# EasyEDA Pro project 电赛云台(升压版).eprj

# Schematic Schematic1

## Sheets
1 主控: Board Name: Board1; Create Date: 2025-06-14; Page Name: 主控; Project Name: 电赛云台(升压版); Schematic Name: Schematic1; Update Date: 2025-07-06; Company: 嘉立创EDA; Page Size: A4; Version: V1.0
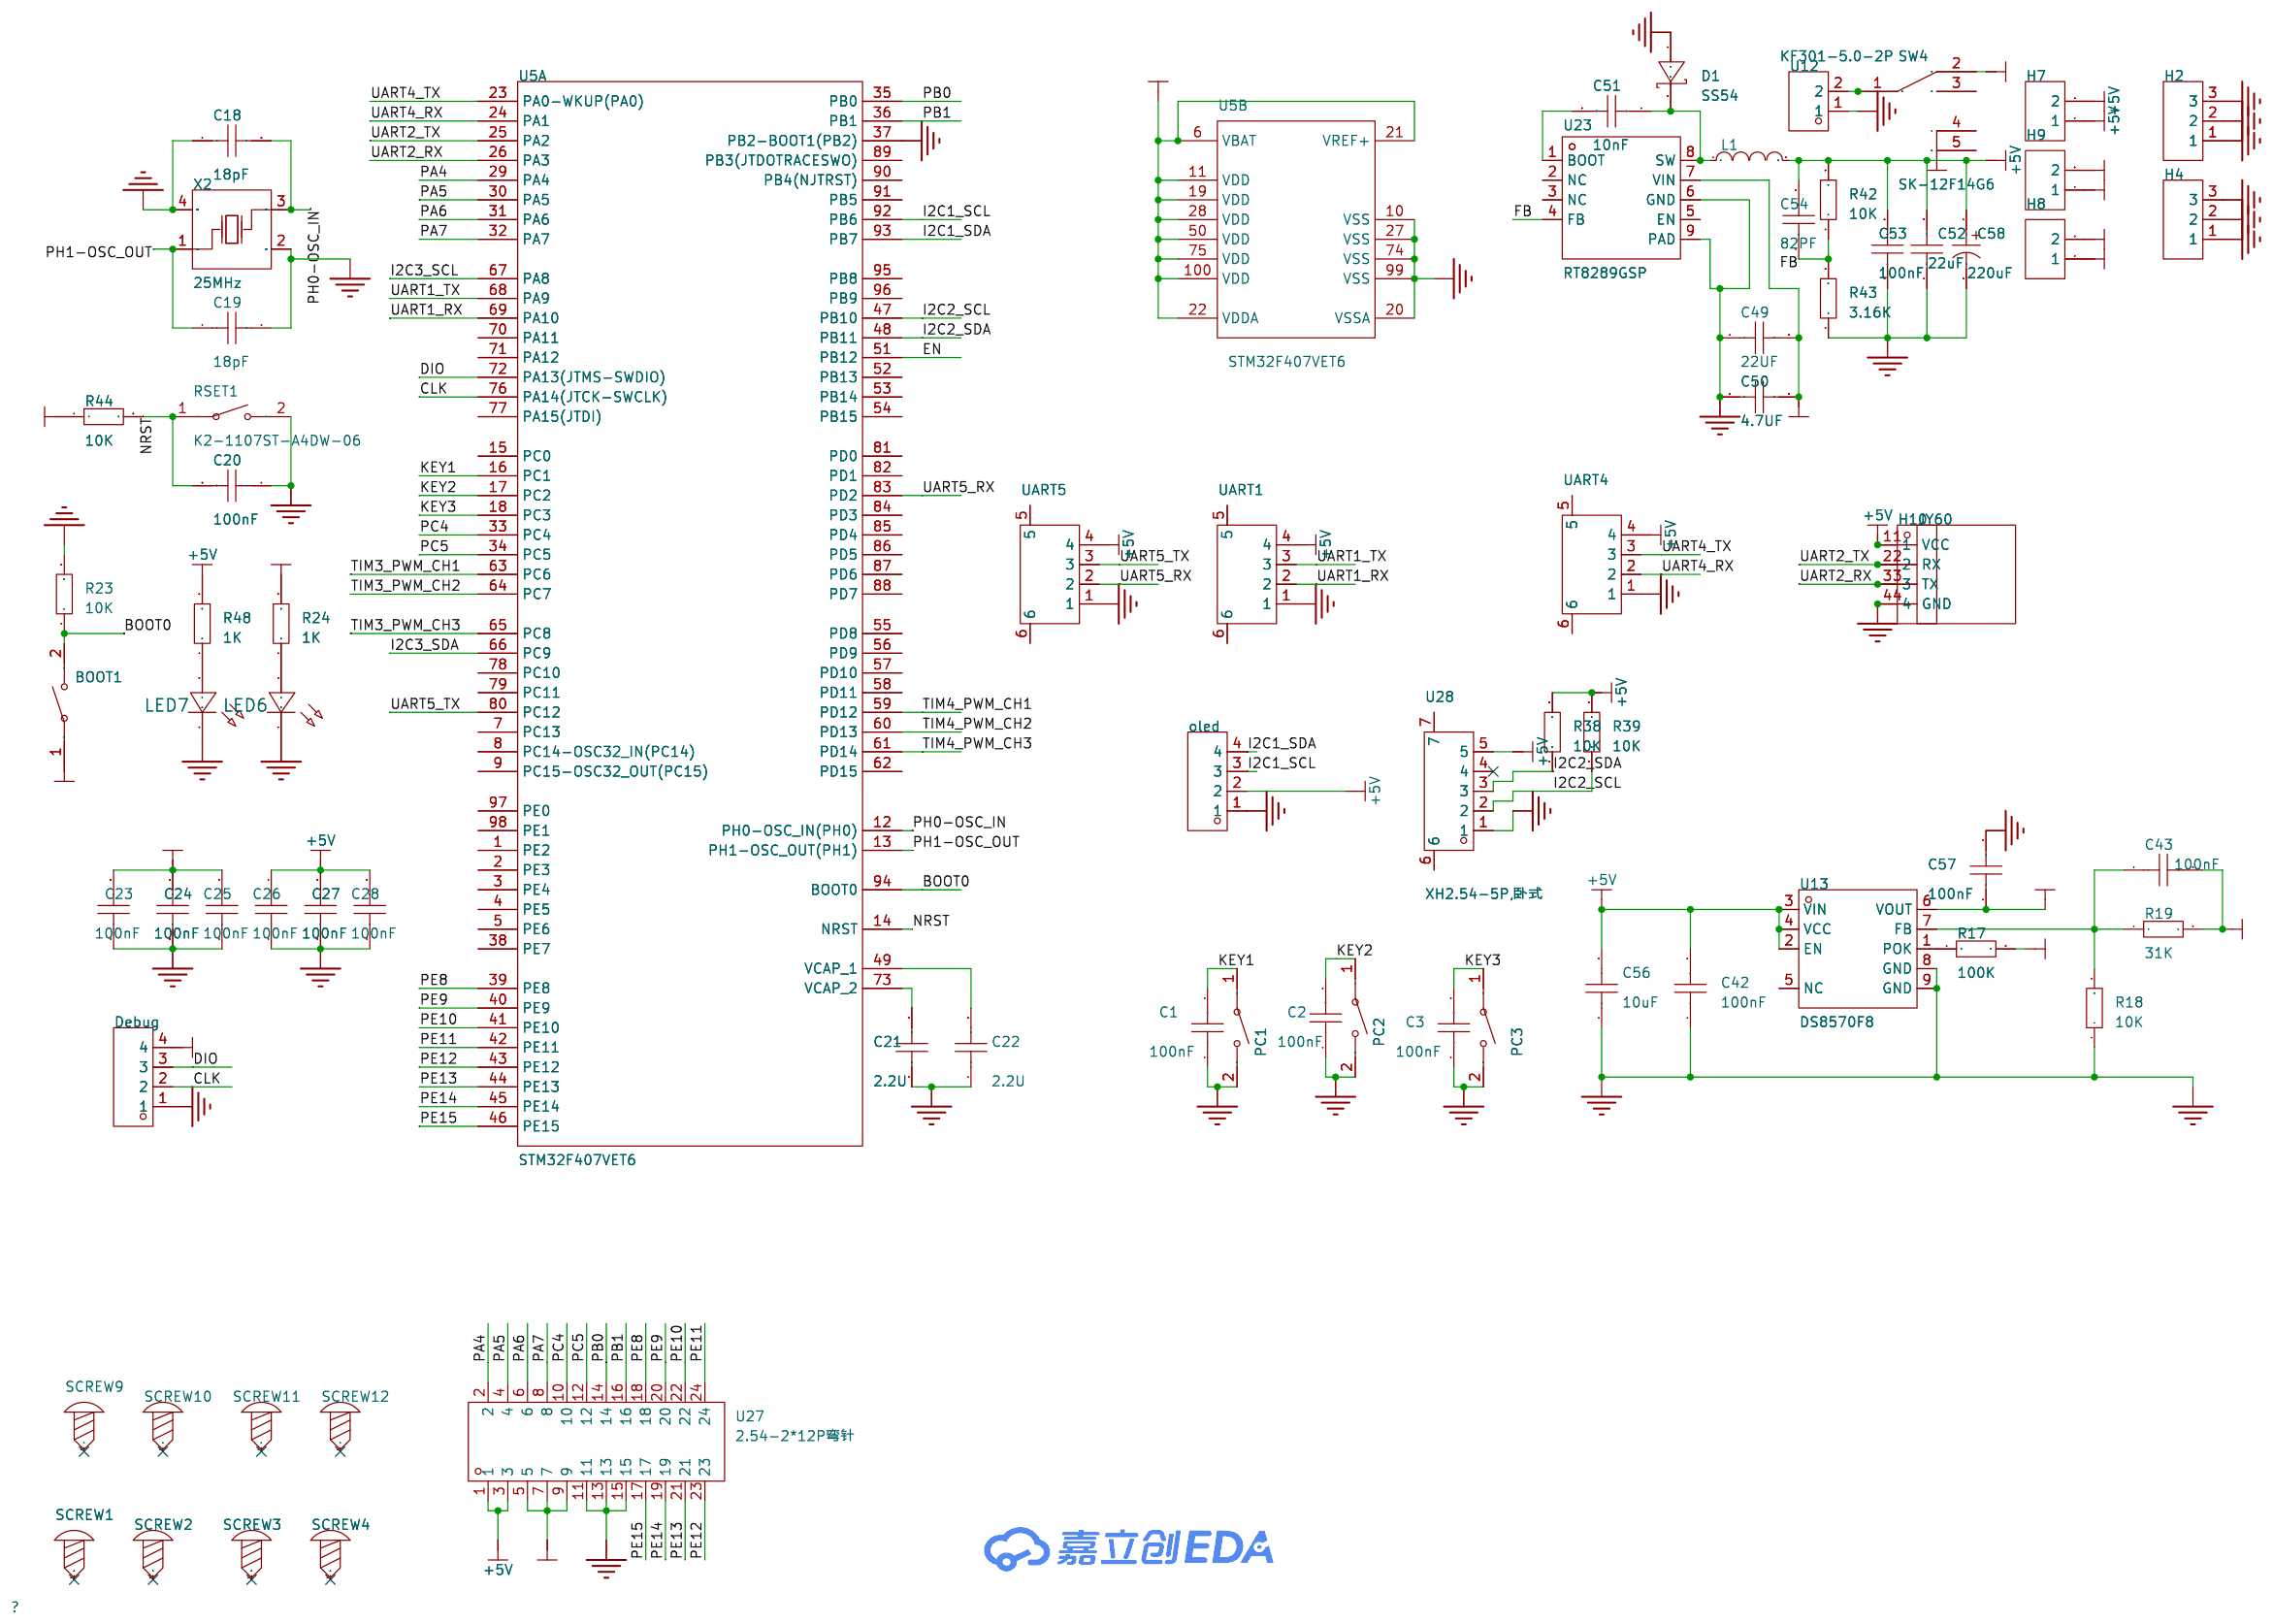
[diagram p0: 主控]
2 驱动: Page Name: 驱动
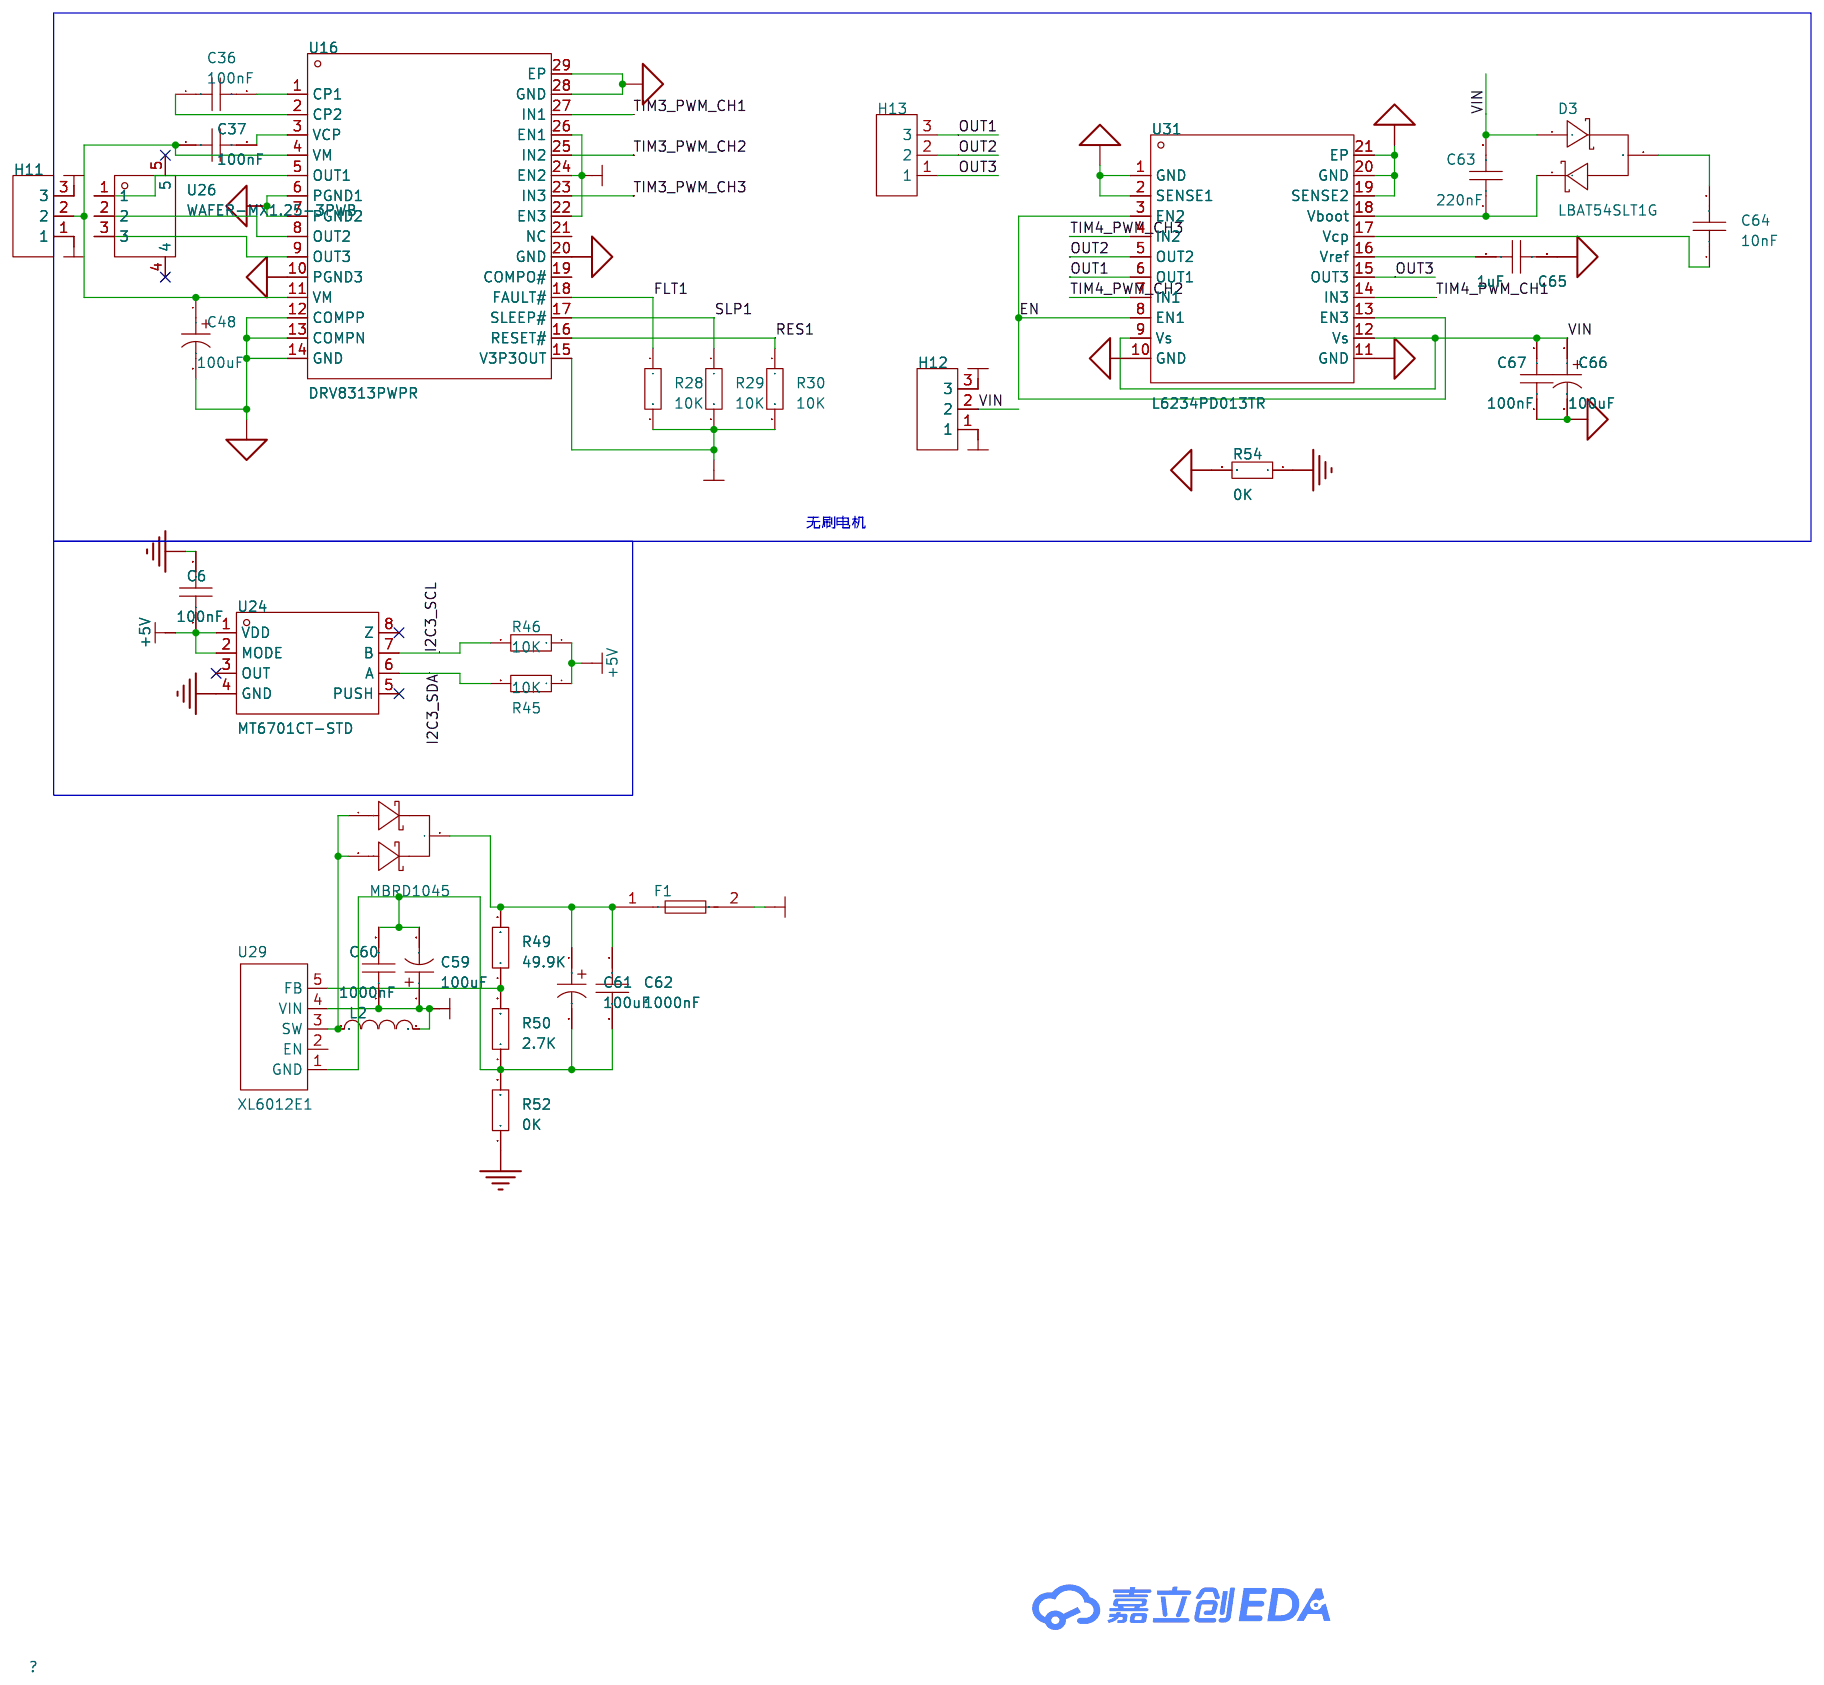
[diagram p1: 驱动]

## Parts
sheet 主控
BOOT1  K2-1107ST-A4DW-06  [KEY-SMD_L6.2-W3.6-LS8.0]
C1  100nF  [C0603]
C2  100nF  [C0603]
C3  100nF  [C0603]
C18  18pF  [C0603]
C19  18pF  [C0603]
C20  100nF  [C0603]
C21  2.2U  [C0805]
C22  2.2U  [C0805]
C23  100nF  [C0603]
C24  100nF  [C0603]
C25  100nF  [C0603]
C26  100nF  [C0603]
C27  100nF  [C0603]
C28  100nF  [C0603]
C42  100nF  [C0603]
C43  100nF  [C0603]
C49  22UF  [C0805]
C50  4.7UF  [C0805]
C51  10nF  [C0805]
C52  22uF  [C0805]
C53  100nF  [C0805]
C54  82PF  [C0805]
C56  10uF  [C0603]
C57  100nF  [C0603]
C58  220uF  [CAP-SMD_BD6.3-L6.6-W6.6-FD]
D1  SS54  [SMA_L4.4-W2.8-LS5.4-R-RD]
Debug  -  [HDR-TH_4P-P2.54-V-F]
H2  -  [HDR-TH_3P-P2.54-V-F]
H4  -  [HDR-TH_3P-P2.54-V-F]
H7  -  [HDR-TH_2P-P2.54-V-F]
H8  -  [HDR-TH_2P-P2.54-V-F]
H9  -  [HDR-TH_2P-P2.54-V-F]
H10  -  [HDR-TH_4P-P2.54-V-F]
JY60  -  [JY60]
L1  APCI00121280150MB2-22uH  [IND-SMD_L12.0-W12.0_744771008]
LED6  -  [LED_0805]
LED7  -  [LED_0805]
oled  -  [HDR-TH_4P-P2.54-V-F]
PC1  K2-1107ST-A4DW-06  [KEY-SMD_L6.2-W3.6-LS8.0]
PC2  K2-1107ST-A4DW-06  [KEY-SMD_L6.2-W3.6-LS8.0]
PC3  K2-1107ST-A4DW-06  [KEY-SMD_L6.2-W3.6-LS8.0]
R17  100K  [R0603]
R18  10K  [R0603]
R19  31K  [R0603]
R23  10K  [R0603]
R24  1K  [R0603]
R38  10K  [R0603]
R39  10K  [R0603]
R42  10K  [R0603]
R43  3.16K  [R0603]
R44  10K  [R0603]
R48  1K  [R0603]
RSET1  K2-1107ST-A4DW-06  [KEY-SMD_L6.2-W3.6-LS8.0]
SCREW1  -  [M3螺丝]
SCREW2  -  [M3螺丝]
SCREW3  -  [M3螺丝]
SCREW4  -  [M3螺丝]
SCREW9  -  [M3螺丝]
SCREW10  -  [M3螺丝]
SCREW11  -  [M3螺丝]
SCREW12  -  [M3螺丝]
SW4  SK-12F14G6  [SW-TH_SK-12F14-G]
U5  STM32F407VET6  [LQFP-100_L14.0-W14.0-P0.50-LS16.0-BL]  (sections 1,2)
U12  KF301-5.0-2P  [CONN-TH_P5.00_KF301-5.0-2P]
U13  DS8570F8  [ESOP-8_L4.9-W3.9-P1.27-LS6.0-BL-EP-1]
U23  RT8289GSP  [SOIC-8_L5.0-W4.0-P1.27-LS6.0-BL-EP2.0]
U27  2.54-2*12P弯针  [HDR-TH_24P-P2.54-H-M-R2-C12-S2.54]
U28  XH2.54-5P,卧式  [CONN-SMD_5P-P2.50_XUNPU_WAFER-254W-5P]
UART1  PH2.0-4P WT  [CONN-SMD_PH2.0-4PWB]
UART4  PH2.0-4P WT  [CONN-SMD_PH2.0-4PWB]
UART5  PH2.0-4P WT  [CONN-SMD_PH2.0-4PWB]
X2  25MHz  [CRYSTAL-SMD_4P-L3.2-W2.5-BL]
sheet 驱动
C6  100nF  [C0603]
C36  100nF  [C0603]
C37  100nF  [C0603]
C48  100uF  [CAP-SMD_BD6.3-L6.6-W6.6-FD]
C59  100uF  [CAP-SMD_BD6.3-L6.6-W6.6-FD]
C60  1000nF  [C0603]
C61  100uF  [CAP-SMD_BD6.3-L6.6-W6.6-FD]
C62  1000nF  [C0603]
C63  220nF  [C0805]
C64  10nF  [C0805]
C65  1uF  [C0805]
C66  100uF  [CAP-SMD_BD6.3-L6.6-W6.6-FD]
C67  100nF  [C0805]
D2  MBRD1045  [TO-252-3_L6.5-W5.9-P4.60-LS10.0-BL]
D3  LBAT54SLT1G  [SOT-23_L2.9-W1.3-P1.90-LS2.4-BR]
F1  保险管座(插件),AC250V/10A,脚距23mm,配φ5  [FUSE-TH_L28.8-W10.0_C9900019320]
H11  -  [HDR-TH_3P-P2.54-V-F]
H12  -  [HDR-TH_3P-P2.54-V-F]
H13  -  [HDR-TH_3P-P2.54-V-F]
L2  APCI00121280150MB2-22uH  [IND-SMD_L12.0-W12.0_744771008]
R28  10K  [R0603]
R29  10K  [R0603]
R30  10K  [R0603]
R45  10K  [R0805]
R46  10K  [R0805]
R49  49.9K  [R0805]
R50  2.7K  [R0805]
R52  0K  [R2010]
R54  0K  [R2010]
U16  DRV8313PWPR  [HTSSOP-28_L9.8-W4.5-P0.65-LS6.6-BL-EP]
U24  MT6701CT-STD  [SOP-8_L4.9-W3.9-P1.27-LS6.0-BL]
U26  WAFER-MX1.25-3PWB  [CONN-SMD_3P-P1.25_WAFER-MX1.25-3PWB]
U29  XL6012E1  [TO-220-5L_L10.2-W4.5-P1.71-L]
U31  L6234PD013TR  [POWERSO20_L15.9-W11.0-P1.27-LS14.2-BL-EP]

## Library data of the parts
BOOT1 PC1-PC3 RSET1 = K2-1107ST-A4DW-06: 电路结构:单刀单掷;按钮形状:矩形按钮;作用力:250gf;安装方式:立贴;开关长度:6.1mm;开关宽度:3.6mm;开关高度:2.5mm;触点电流:50mA;额定电压(DC):12V;绝缘电阻:100MΩ;带灯:-;机械寿命:10万次;; LCSC Part Name: 轻触开关 3.6*6.1*2.5; Supplier Part: C118141; Manufacturer: 韩国韩荣; Supplier Footprint: SMD; JLCPCB Part Class: 扩展库; Datasheet: https://atta.szlcsc.com/upload/public/pdf/source/20210810/381712CEF248770C072B585C3485C888.pdf; Supplier: LCSC; Circuit: 单刀单掷; Actuator Style: 矩形按钮; Operating Force: 250gf; Mounting Style: 立贴; Switch Length: 6.1mm; Switch Width: 3.6mm; Switch Height: 2.5mm; Contact Current: 50mA; Voltage Rating (DC): 12V; Insulation Resistance: 100MΩ; Mechanical Life: 10万次; Operating Temperature: -25℃~+85℃
C1-C3 C6 C18-C20 C23-C28 C36 C37 C42 C43 C56 C57 C60 C62 = CAP_0603: Supplier Footprint: 0603
C21 C22 C49-C54 C63-C65 C67 = CAP_0805: Supplier Footprint: 0805
C48 C58 C59 C61 C66 = VPXC0851V101MVTM: 容值:100uF;精度:±20%;额定电压:35V;; LCSC Part Name: 100uF ±20% 35V; Supplier Part: C20539626; Manufacturer: Ymin(永铭); Supplier Footprint: SMD,D6.3xL8.5mm; Datasheet: https://atta.szlcsc.com/upload/public/pdf/source/20240111/6A0CA21230FBAF330158590F32FAE995.pdf; Supplier: LCSC; Tolerance: ±20%; Voltage Rating: 35V; Diameter: 6.3mm; Height - Seated (Max): 8.5mm; Lifetime: 2000hrs@105℃
D1 = SS54_C22452: 二极管配置:独立式;正向压降(Vf):550mV@5A;直流反向耐压(Vr):40V;整流电流:5A;; LCSC Part Name: 电压:40V 电流:5A; Supplier Part: C22452; Manufacturer: MDD(辰达半导体); Supplier Footprint: SMA(DO-214AC); JLCPCB Part Class: 基础库; Datasheet: https://atta.szlcsc.com/upload/public/pdf/source/20240710/73DFBB65C1883B895E62D589679033DF.pdf; Supplier: LCSC; Diode Configuration: 独立式; Forward Voltage (Vf@If): 550mV@5A; Reverse Voltage (Vr): 40V; Rectified Current: 5A; Reverse Leakage Current (Ir): 1mA@40V
Debug H10 oled = HDR-F_2.54_1x4P: Supplier Part: C2718488; Supplier Footprint: 插件
H2 H4 H11-H13 = HDR-F_2.54_1x3P: Supplier Part: C541850; Supplier Footprint: 插件
H7-H9 = HDR-F_2.54_1x2P: Supplier Part: C49661; Supplier Footprint: 插件
JY60 = JY60
L1 L2 = APCI00121280150MB2-22uH: Supplier Part: C9900006262; Supplier Footprint: IND-SMD_L12.0-W12.0; JLCPCB Part Class: 扩展库; Supplier: LCSC
LED6 LED7 = LED_0805-R: Supplier Footprint: 0805
R17-R19 R23 R24 R28-R30 R38 R39 R42-R44 R48 = Res_0603: Supplier Footprint: 0603
SCREW1-SCREW4 SCREW9-SCREW12 = M3螺丝: Supplier Footprint: 插件
SW4 = SK-12F14G6: 操作侧拨 插件卧式 尺寸中型 两档位; Supplier Part: C22355833; Manufacturer: SOFNG(硕方); Supplier Footprint: 插件; JLCPCB Part Class: 扩展库; Datasheet: https://atta.szlcsc.com/upload/public/pdf/source/20240628/6329913720921E826F41D15FA1CAD15E.pdf; Supplier: LCSC
U5 = STM32F407VET6: CPU内核:ARM-M4;CPU最大主频:168MHz;应用领域:-;; LCSC Part Name: 带DSP和FPU的高性能基础系列ARM Cortex-M4 MCU，具有512 KB Flash、168 MHz CPU、ART加速器、以太网和FSMC; Supplier Part: C28730; Manufacturer: ST(意法半导体); Supplier Footprint: LQFP-100(14x14); JLCPCB Part Class: 扩展库; Datasheet: https://atta.szlcsc.com/upload/public/pdf/source/20140801/1457707197138.pdf; Supplier: LCSC; CPU Core: ARM-M4; CPU Maximum Speed: 168MHz; Program Storage Size: 512KB; Program Memory Type: FLASH; Number of I/O: 82; ADC (Bit): 12bit; DAC (Bit): 12bit; Low Voltage Detection Threshold: 1.8V~3.6V
U12 = KF301-5.0-2P: 结构:1x2P;间距:5mm;颜色:蓝色;安装方式:直插;额定电流:17A;额定电压:250V;排数:1;线规 - AWG:14~22;线规 - 平方毫米:1.5;每排PIN数:2;工作温度范围:-30℃~+120℃;; LCSC Part Name: 5mm 1x2P 排数:1 每排P数:2 直插; Supplier Part: C474881; Manufacturer: KEFA(科发); Supplier Footprint: 插件,P=5mm; JLCPCB Part Class: 扩展库; Datasheet: https://atta.szlcsc.com/upload/public/pdf/source/20230317/03A5B5FC229D6F9225E8F51DA1A4E80A.pdf; Supplier: LCSC; Structure: 1x2P; Pitch: 5mm; Color: 蓝色; Mounting Style: 直插; Current Rating (Max): 17A; Voltage Rating (Max): 250V; Number of Pins: 2P; Number of Rows: 1; Wire Gauge - AWG: 14~22; Wire Gauge - mm2: 1.5; Number of PINs Per Row: 2; Operating Temperature Range: -30℃~+120℃
U13 = DS8570F8: 输出类型:可调;最大输入电压:-;输出电压:800mV~3.3V;最大输出电流:3A;输出极性:正极;; LCSC Part Name: 3A大电流LDO; Supplier Part: C5884245; Manufacturer: DSTECH(奥简科技); Supplier Footprint: ESOP-8; JLCPCB Part Class: 扩展库; Datasheet: https://atta.szlcsc.com/upload/public/pdf/source/20230630/AC4496CC740A7C367D4C31694D5F3C7D.pdf; Supplier: LCSC; Output Type: 可调; Output Voltage: 800mV~3.3V; MAX Output Current: 3A; Dropout Voltage: 250mV@2A; standby current: 600uA; Operating Temperature: -40℃~+85℃; Output Polarity: 正极; Number of Outputs: 1
U23 = RT8289GSP: 功能类型:降压型;输出类型:可调;工作电压:5.5V~32V;输出电压:1.222V~26V;输出电流:5A;; LCSC Part Name: 5A 32V 500kHz 降压转换器; Supplier Part: C39202; Manufacturer: RICHTEK(立锜); Supplier Footprint: SOIC-8-EP; JLCPCB Part Class: 扩展库; Datasheet: https://atta.szlcsc.com/upload/public/pdf/source/20141219/1457707253176.pdf; Supplier: LCSC; Function: 降压型; Output Type: 可调; Input Voltage: 5.5V~32V; Output Voltage: 1.222V~26V; Output Current: 5A; Switching Frequency: 500kHz; Operating Temperature: -40℃~+125℃; Synchronous Rectification: 否; Number of Outputs: 1; Topology: 降压式; Quiescent Current (Iq): 25uA; Switch tube (built-in/external): 内置
U27 = 2.54-2*12P弯针: LCSC Part Name: 2*12P双排弯针; Supplier Part: C668224; Manufacturer: BOOMELE(博穆精密); Supplier Footprint: 插件,P=2.54mm; JLCPCB Part Class: 扩展库; Datasheet: https://atta.szlcsc.com/upload/public/pdf/source/20250418/F3A60B1E5E03CEB8832536EA18069B7C.pdf; Supplier: LCSC
U28 = XH2.54-5P,卧式: Supplier Part: C9900019986; Supplier Footprint: CONN-SMD_5P-P2.50; JLCPCB Part Class: 扩展库; Supplier: LCSC
UART1 UART4 UART5 = PH2.0-4P WT: Supplier Part: C9900002982; Supplier Footprint: SMD-4_P=2mm; JLCPCB Part Class: 扩展库; Supplier: LCSC
X2 = X322525MOB4SI: 晶振类型:贴片晶振;频率:25MHz;常温频差:±10ppm;负载电容:12pF;频率稳定度(全温):±20ppm;; LCSC Part Name: 25MHz ±10ppm 12pF; Supplier Part: C9006; Manufacturer: YXC(扬兴晶振); Supplier Footprint: SMD3225-4P; JLCPCB Part Class: 基础库; Datasheet: https://atta.szlcsc.com/upload/public/pdf/source/20240329/19D5F850207469550BEB00D7DFEDBC7A.pdf; Supplier: LCSC; Crystal Type: 贴片晶振; Normal temperature Frequency Tolerance: ±10ppm; Load Capacitor: 12pF; Frequency Stability(Full temperature range): ±20ppm; Operating Temperature: -40℃~+85℃
D2 = MBRD1045: LCSC Part Name: 电压:45V 电流:10A; Supplier Part: C5137764; Manufacturer: GOODWORK(固得沃克); Supplier Footprint: TO-252; Datasheet: https://atta.szlcsc.com/upload/public/pdf/source/20220811/0184EE9629AA1C466BA3600FC4FB457A.pdf; Supplier: LCSC; Diode Configuration: 1对共阴极; Voltage - Forward(Vf@If): 600mV@10A; Voltage - DC Reverse(Vr): 45V; Current - Rectified: 10A; Reverse Leakage Current (Ir): 100uA
D3 = LBAT54SLT1G: LCSC Part Name: 电压:30V 电流:200mA; Supplier Part: C12765; Manufacturer: LRC(乐山无线电); Supplier Footprint: SOT-23; JLCPCB Part Class: 扩展库; Datasheet: https://atta.szlcsc.com/upload/public/pdf/source/20130604/1457706606553.pdf; Supplier: LCSC; Voltage - Forward(Vf@If): 400mV; Voltage - DC Reverse(Vr): 30V; Current - Rectified: 200mA; Reverse Leakage Current (Ir): 2uA
F1 = 保险管座(插件),AC250V/10A,脚距23mm,配φ5: Supplier Part: C9900019320; Supplier Footprint: FUSE-TH; JLCPCB Part Class: 扩展库; Supplier: LCSC
R45 R46 R49 R50 = Res_0805: Supplier Footprint: 0805
R52 R54 = Res_1206: Supplier Footprint: 1206
U16 = DRV8313PWPR: DRV8313 具有集成 FET、65V 最大电压、3A 峰值电流的三相电机驱动器; LCSC Part Name: 无刷直流BLDC电机驱动芯片 60V; Supplier Part: C92482; Manufacturer: TI(德州仪器); Supplier Footprint: HTSSOP-28-EP-4.5mm; JLCPCB Part Class: 扩展库; Datasheet: https://www.ti.com/cn/lit/gpn/drv8313; Supplier: LCSC
U24 = MT6701CT-STD: 磁性编码器 磁性编码开关 磁性角度检测IC 可编程磁性角度位置芯片; LCSC Part Name: 霍尔在线编程角度位置传感器; Supplier Part: C2856764; Manufacturer: MagnTek(麦歌恩); Supplier Footprint: SOP-8; JLCPCB Part Class: 扩展库; Datasheet: https://atta.szlcsc.com/upload/public/pdf/source/20210901/89396AA55DF26524CEF7734A3D9C2FB3.pdf; Supplier: LCSC
U26 = WAFER-MX1.25-3PWB: 插针结构:1x3P;间距:1.25mm;安装方式:卧贴;参考系列:PicoBlade(MX 1.25);总PIN数:3P;排数:1;每排PIN数:3;行距:-;额定电流:1A;触头材质:黄铜;触头镀层:-;工作温度:-25℃~+85℃;; LCSC Part Name: 1x3P 间距:1.25mm 卧贴 系列:PicoBlade(MX 1.25); Supplier Part: C3029360; Manufacturer: XUNPU(讯普); Supplier Footprint: SMD,P=1.25mm,卧贴; JLCPCB Part Class: 扩展库; Datasheet: https://atta.szlcsc.com/upload/public/pdf/source/20220527/5ACBB683E384B6AD06743F272F933620.pdf; Supplier: LCSC; Pins Structure: 1x3P; Pitch: 1.25mm; Mounting Type: 卧贴; Reference Series: PicoBlade(MX 1.25); Number of Pins: 3P; Number of Rows: 1; Number of PINs Per Row: 3; Current Rating: 1A; Contact Material: 黄铜; Operating Temperature: -25℃~+85℃; Voltage Rating: 125V; Plastic Material: LCP; Supplementary Features: 辅助焊脚; Color: 米色; Z-Height of the Board: 3.6mm; X-Length of Bottom Edge on Board (Spacing Line): 8.75mm; Y-Width of Bottom Edge on Board: 5.25mm
U29 = XL6012E1: LCSC Part Name: 180KHz 60V 5A 开关电流升压DC/DC转换器; Supplier Part: C126472; Manufacturer: XLSEMI(芯龙); Supplier Footprint: TO-220-5; JLCPCB Part Class: 扩展库; Datasheet: https://atta.szlcsc.com/upload/public/pdf/source/20170818/C126472_1503051271252895316.pdf; Supplier: LCSC; Function: 升压型; Output Type: 可调; Voltage - Supply: 5V~40V; Output Current: 5A; Frequency - Switching: 144kHz~216kHz; Operating Temperature: -40℃~+125℃@(TJ); Synchronous Rectifier: 否; Number of Outputs: 1; Topology: 升压式；SEPIC；反激式；反相式; Quiescent Current: 3.5mA; Switch tube (built-in/external): 内置
U31 = L6234PD013TR: LCSC Part Name: 4A 无刷直流BLDC电机驱动芯片 52V; Supplier Part: C77581; Manufacturer: ST(意法半导体); Supplier Footprint: SOIC-20-EP-11mm; JLCPCB Part Class: 扩展库; Datasheet: https://atta.szlcsc.com/upload/public/pdf/source/20160702/1467448307879.pdf; Supplier: LCSC

## Nets
+3.3V: BOOT1.1 C23.2 C24.2 C25.2 C43.2 C57.1 Debug.4 H9.1 H9.2 R17.2 R19.2 R24.2 R28.2 R29.2 R30.2 R44.1 U5.6(VBAT) U5.11(VDD) U5.19(VDD) U5.21(VREF+) U5.22(VDDA) U5.28(VDD) U5.50(VDD) U5.75(VDD) U5.100(VDD) U13.6(VOUT) U16.15(V3P3OUT) U16.22(EN3) U16.24(EN2) U16.26(EN1) U27.5 U27.7 U27.9
+5V: C6.1 C26.2 C27.2 C28.2 C42.2 C52.2 C53.2 C54.2 C56.2 C58.1 H7.1 H7.2 H10.1 JY60.1(VCC) L1.2 oled.2 R38.2 R39.2 R42.2 R45.1 R46.1 R48.2 U13.2(EN) U13.3(VIN) U13.4(VCC) U24.1(VDD) U24.2(MODE) U27.1 U27.3 U28.5 UART1.4 UART4.4 UART5.4
+12V: C49.2 C50.2 C59.1 C60.1 H8.1 H8.2 H11.3 H12.3 L2.2 SW4.2 U23.7(VIN) U29.4(VIN)
+24V: F1.2 H11.1 H12.1
AGND: C48.2 C65.2 C66.2 C67.1 R54.2 U16.6(PGND1) U16.7(PGND2) U16.10(PGND3) U16.12(COMPP) U16.13(COMPN) U16.14(GND) U16.20(GND) U16.28(GND) U16.29(EP) U31.1(GND) U31.2(SENSE1) U31.10(GND) U31.11(GND) U31.19(SENSE2) U31.20(GND) U31.21(EP)
GND: C1.1 C2.1 C3.1 C6.2 C18.1 C19.2 C20.1 C21.1 C22.1 C23.1 C24.1 C25.1 C26.1 C27.1 C28.1 C42.1 C49.1 C50.1 C52.1 C53.1 C56.1 C57.2 C58.2 D1.1(A) Debug.1 H2.1 H2.2 H2.3 H4.1 H4.2 H4.3 H10.4 JY60.4(GND) LED6.1(C) LED7.1(C) oled.1 PC1.2 PC2.2 PC3.2 R18.1 R23.2 R43.1 R52.1 R54.1 RSET1.2 U5.10(VSS) U5.20(VSSA) U5.27(VSS) U5.37(PB2-BOOT1(PB2)) U5.74(VSS) U5.99(VSS) U12.1 U13.8(GND) U13.9(GND) U23.6(GND) U23.9(PAD) U24.4(GND) U27.11 U27.13 U27.15 U28.1 UART1.1 UART4.1 UART5.1 X2.2(GND) X2.4(GND)
VIN: C63.2 C66.1 C67.2 D3.1(A) H12.2 U31.9(Vs) U31.12(Vs)
BOOT0: BOOT1.2 R23.1 U5.94(BOOT0)
CLK: Debug.2 U5.76(PA14(JTCK-SWCLK))
DIO: Debug.3 U5.72(PA13(JTMS-SWDIO))
EN: U5.51(PB12) U31.3(EN2) U31.8(EN1) U31.13(EN3)
FB: C54.1 R42.1 R43.2 U23.4(FB)
FLT1: R28.1 U16.18(FAULT#)
I2C1_SCL: oled.3 U5.92(PB6)
I2C1_SDA: oled.4 U5.93(PB7)
I2C2_SCL: R39.1 U5.47(PB10) U28.2
I2C2_SDA: R38.1 U5.48(PB11) U28.3
I2C3_SCL: R46.2 U5.67(PA8) U24.7(B)
I2C3_SDA: R45.2 U5.66(PC9) U24.6(A)
KEY1: C1.2 PC1.1 U5.16(PC1)
KEY2: C2.2 PC2.1 U5.17(PC2)
KEY3: C3.2 PC3.1 U5.18(PC3)
NRST: C20.2 R44.2 RSET1.1 U5.14(NRST)
OUT1: H13.3 U31.6(OUT1)
OUT2: H13.2 U31.5(OUT2)
OUT3: H13.1 U31.15(OUT3)
PA4: U5.29(PA4) U27.2
PA5: U5.30(PA5) U27.4
PA6: U5.31(PA6) U27.6
PA7: U5.32(PA7) U27.8
PB0: U5.35(PB0) U27.14
PB1: U5.36(PB1) U27.16
PC4: U5.33(PC4) U27.10
PC5: U5.34(PC5) U27.12
PE8: U5.39(PE8) U27.18
PE9: U5.40(PE9) U27.20
PE10: U5.41(PE10) U27.22
PE11: U5.42(PE11) U27.24
PE12: U5.43(PE12) U27.23
PE13: U5.44(PE13) U27.21
PE14: U5.45(PE14) U27.19
PE15: U5.46(PE15) U27.17
PH0-OSC_IN: C18.2 U5.12(PH0-OSC_IN(PH0)) X2.3(OSC2)
PH1-OSC_OUT: C19.1 U5.13(PH1-OSC_OUT(PH1)) X2.1(OSC1)
RES1: R30.1 U16.16(RESET#)
SLP1: R29.1 U16.17(SLEEP#)
TIM3_PWM_CH1: U5.63(PC6) U16.27(IN1)
TIM3_PWM_CH2: U5.64(PC7) U16.25(IN2)
TIM3_PWM_CH3: U5.65(PC8) U16.23(IN3)
TIM4_PWM_CH1: U5.59(PD12) U31.14(IN3)
TIM4_PWM_CH2: U5.60(PD13) U31.7(IN1)
TIM4_PWM_CH3: U5.61(PD14) U31.4(IN2)
UART1_RX: U5.69(PA10) UART1.2
UART1_TX: U5.68(PA9) UART1.3
UART2_RX: H10.3 JY60.3(TX) U5.26(PA3)
UART2_TX: H10.2 JY60.2(RX) U5.25(PA2)
UART4_RX: U5.24(PA1) UART4.2
UART4_TX: U5.23(PA0-WKUP(PA0)) UART4.3
UART5_RX: U5.83(PD2) UART5.2
UART5_TX: U5.80(PC12) UART5.3
$1N7351: C21.2 U5.73(VCAP_2)
$1N7352: C22.2 U5.49(VCAP_1)
$1N7359: LED6.2(A) R24.1
$1N7616: C51.2 U23.1(BOOT)
$1N7617: C51.1 D1.2(K) L1.1 U23.8(SW)
$1N7627: SW4.1 U12.2
$1N10476: R17.1 U13.1(POK)
$1N10481: C43.1 R18.2 R19.1 U13.7(FB)
$1N13161: LED7.2(A) R48.1
$2N858: C36.2 U16.1(CP1)
$2N859: C36.1 U16.2(CP2)
$2N860: C37.2 U16.3(VCP)
$2N861: C37.1 C48.1 H11.2 U16.4(VM) U16.11(VM)
$2N862: U16.5(OUT1) U26.1
$2N863: U16.8(OUT2) U26.2
$2N864: U16.9(OUT3) U26.3
$2N3678: C59.2 C60.2 C61.2 C62.2 R50.1 R52.2 U29.1(GND)
$2N3848: D2.1(A) D2.3(A) L2.1 U29.3(SW)
$2N3894: R49.1 R50.2 U29.5(FB)
$2N4058: C61.1 C62.1 D2.2(K) F1.1 R49.2
$2N9131: C63.1 D3.2(K) U31.18(Vboot)
$2N9137: C64.2 D3.3(AK)
$2N9204: C64.1 U31.17(Vcp)
$2N9259: C65.1 U31.16(Vref)

Not connected (* = marked no-connect by the designer): SCREW1 1*; SCREW2 1*; SCREW3 1*; SCREW4 1*; SCREW9 1*; SCREW10 1*; SCREW11 1*; SCREW12 1*; SW4 3 4 5; U5 1(PE2) 2(PE3) 3(PE4) 4(PE5) 5(PE6) 7(PC13) 8(PC14-OSC32_IN(PC14)) 9(PC15-OSC32_OUT(PC15)) 15(PC0) 38(PE7) 52(PB13) 53(PB14) 54(PB15) 55(PD8) 56(PD9) 57(PD10) 58(PD11) 62(PD15) 70(PA11) 71(PA12) 77(PA15(JTDI)) 78(PC10) 79(PC11) 81(PD0) 82(PD1) 84(PD3) 85(PD4) 86(PD5) 87(PD6) 88(PD7) 89(PB3(JTDOTRACESWO)) 90(PB4(NJTRST)) 91(PB5) 95(PB8) 96(PB9) 97(PE0) 98(PE1); U13 5(NC); U16 19(COMPO#) 21(NC); U23 2(NC) 3(NC) 5(EN); U24 3(OUT)* 5(PUSH)* 8(Z)*; U26 4* 5*; U28 4* 6 7; U29 2(EN); UART1 5 6; UART4 5 6; UART5 5 6

## Notes on the sheets
sheet 2
- 无刷电机

# Board PCB1
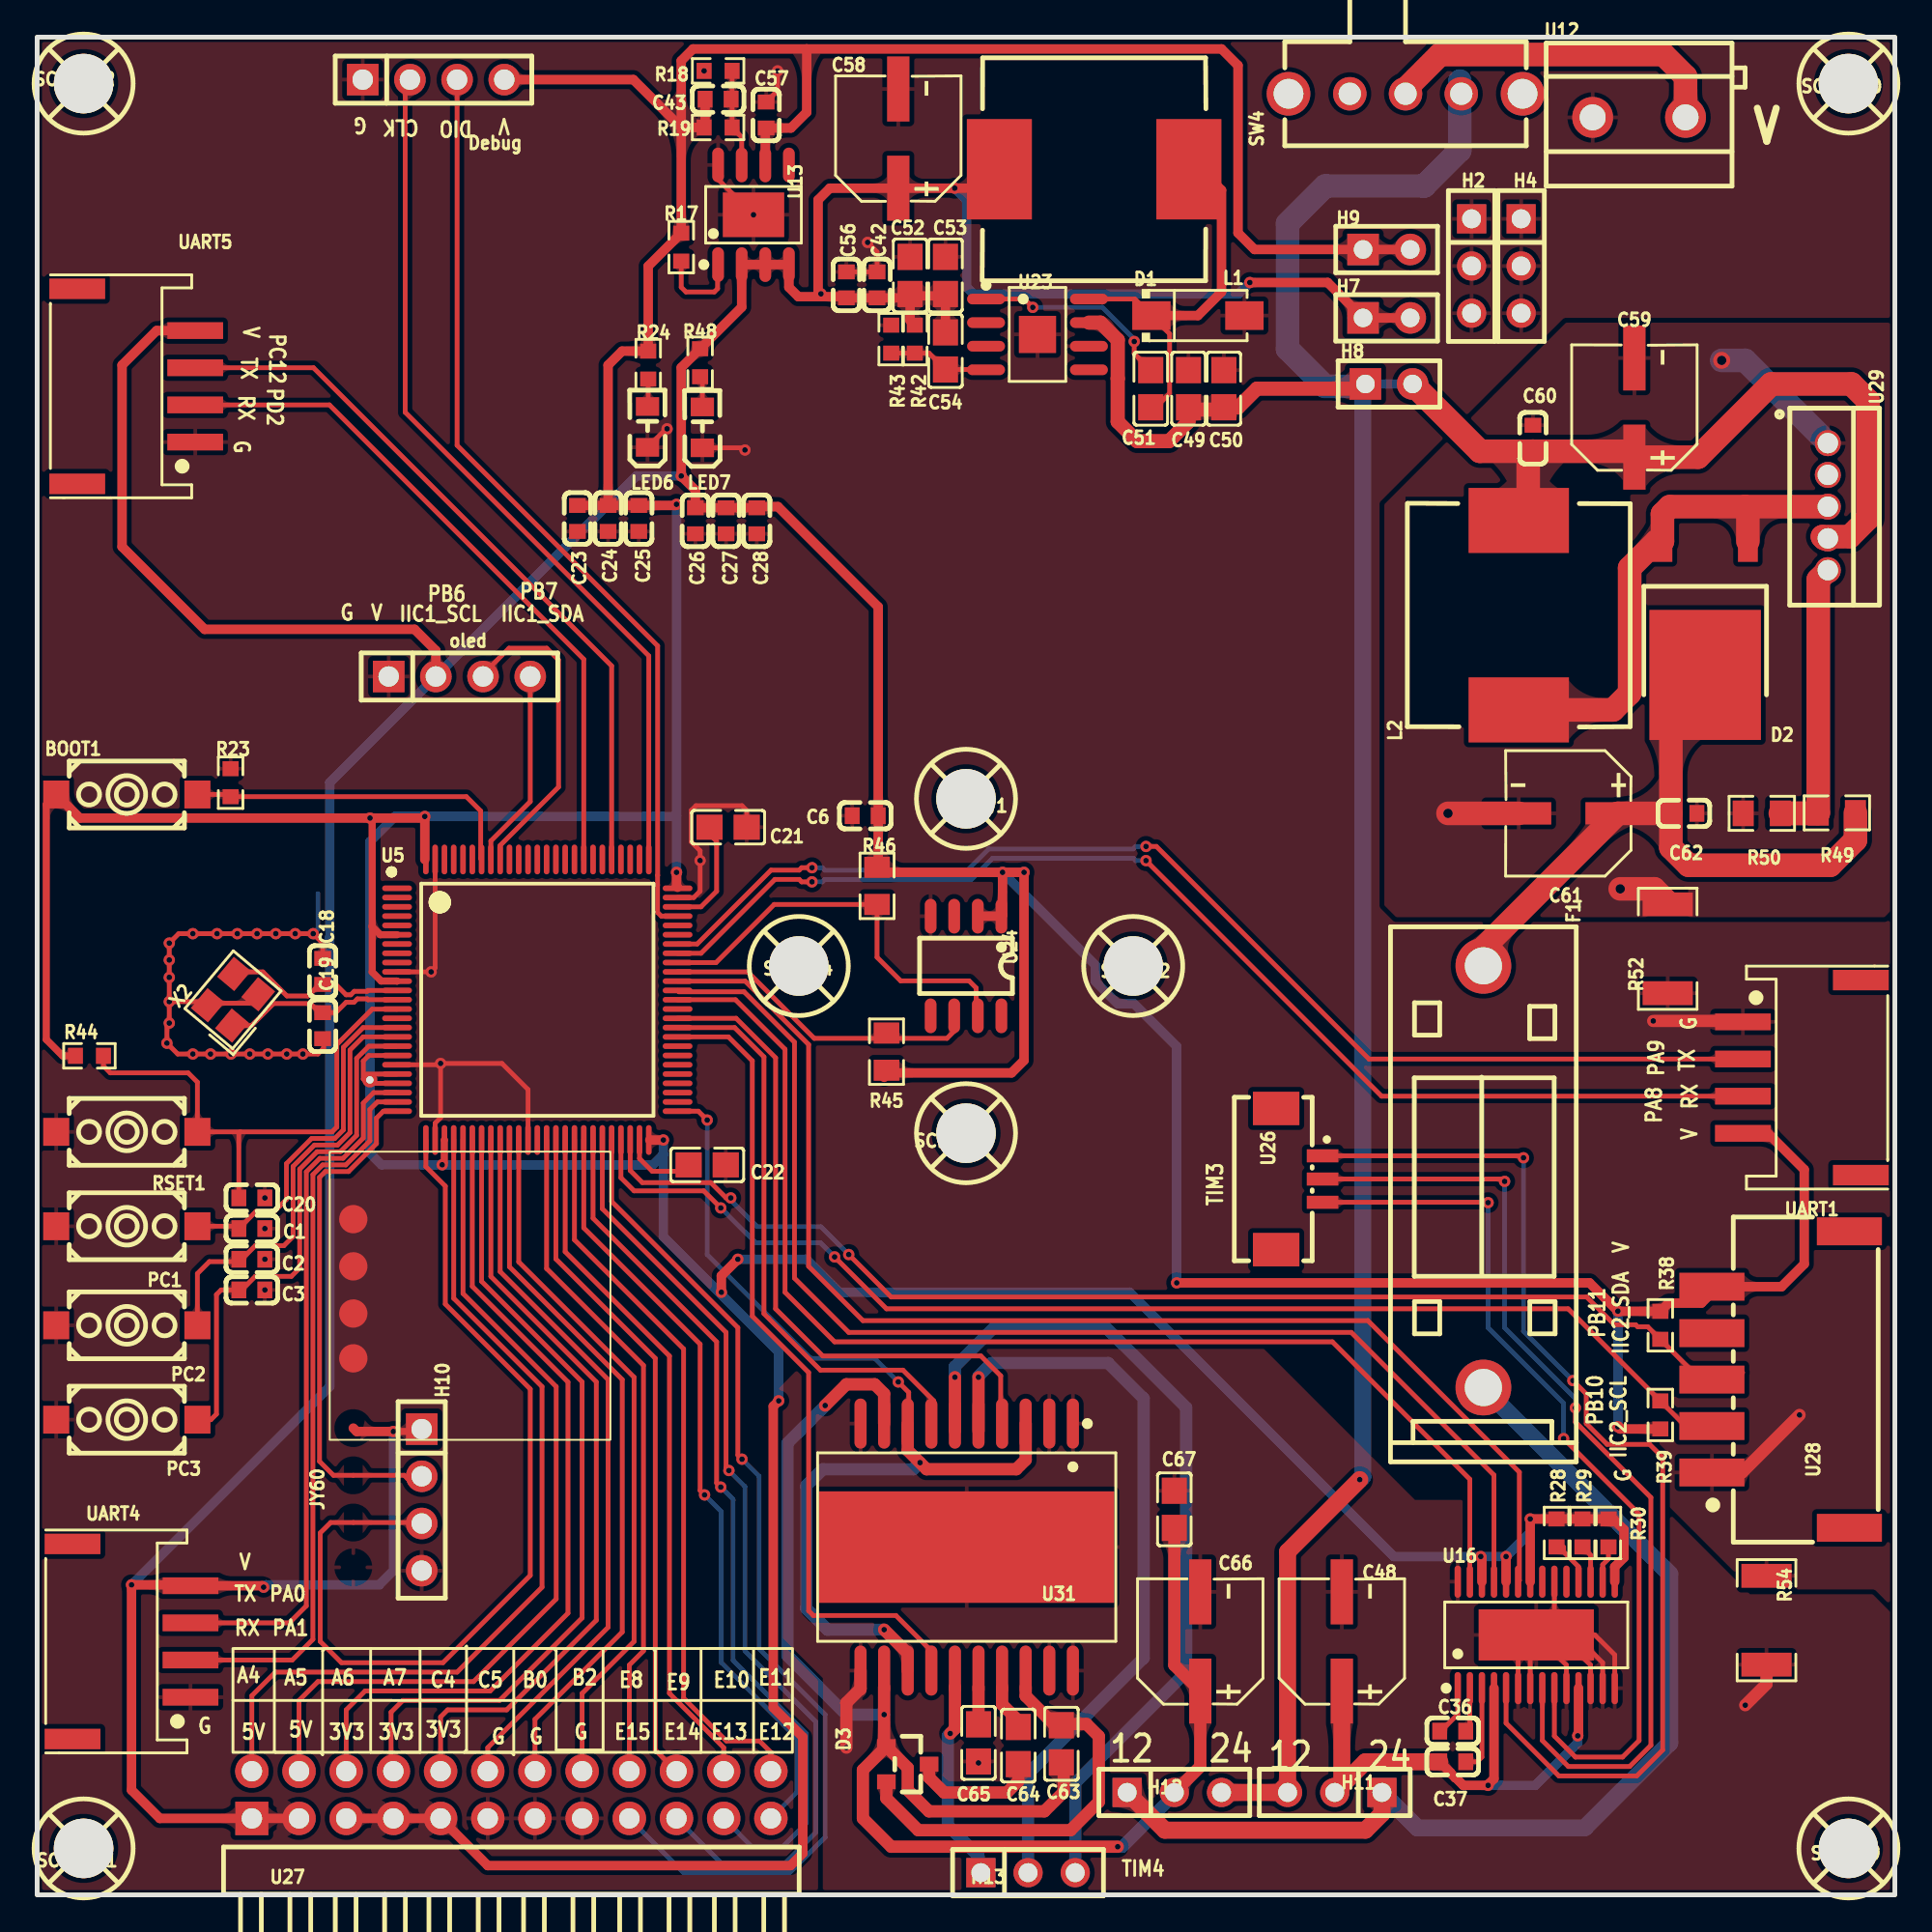
[diagram p2: board, top side]
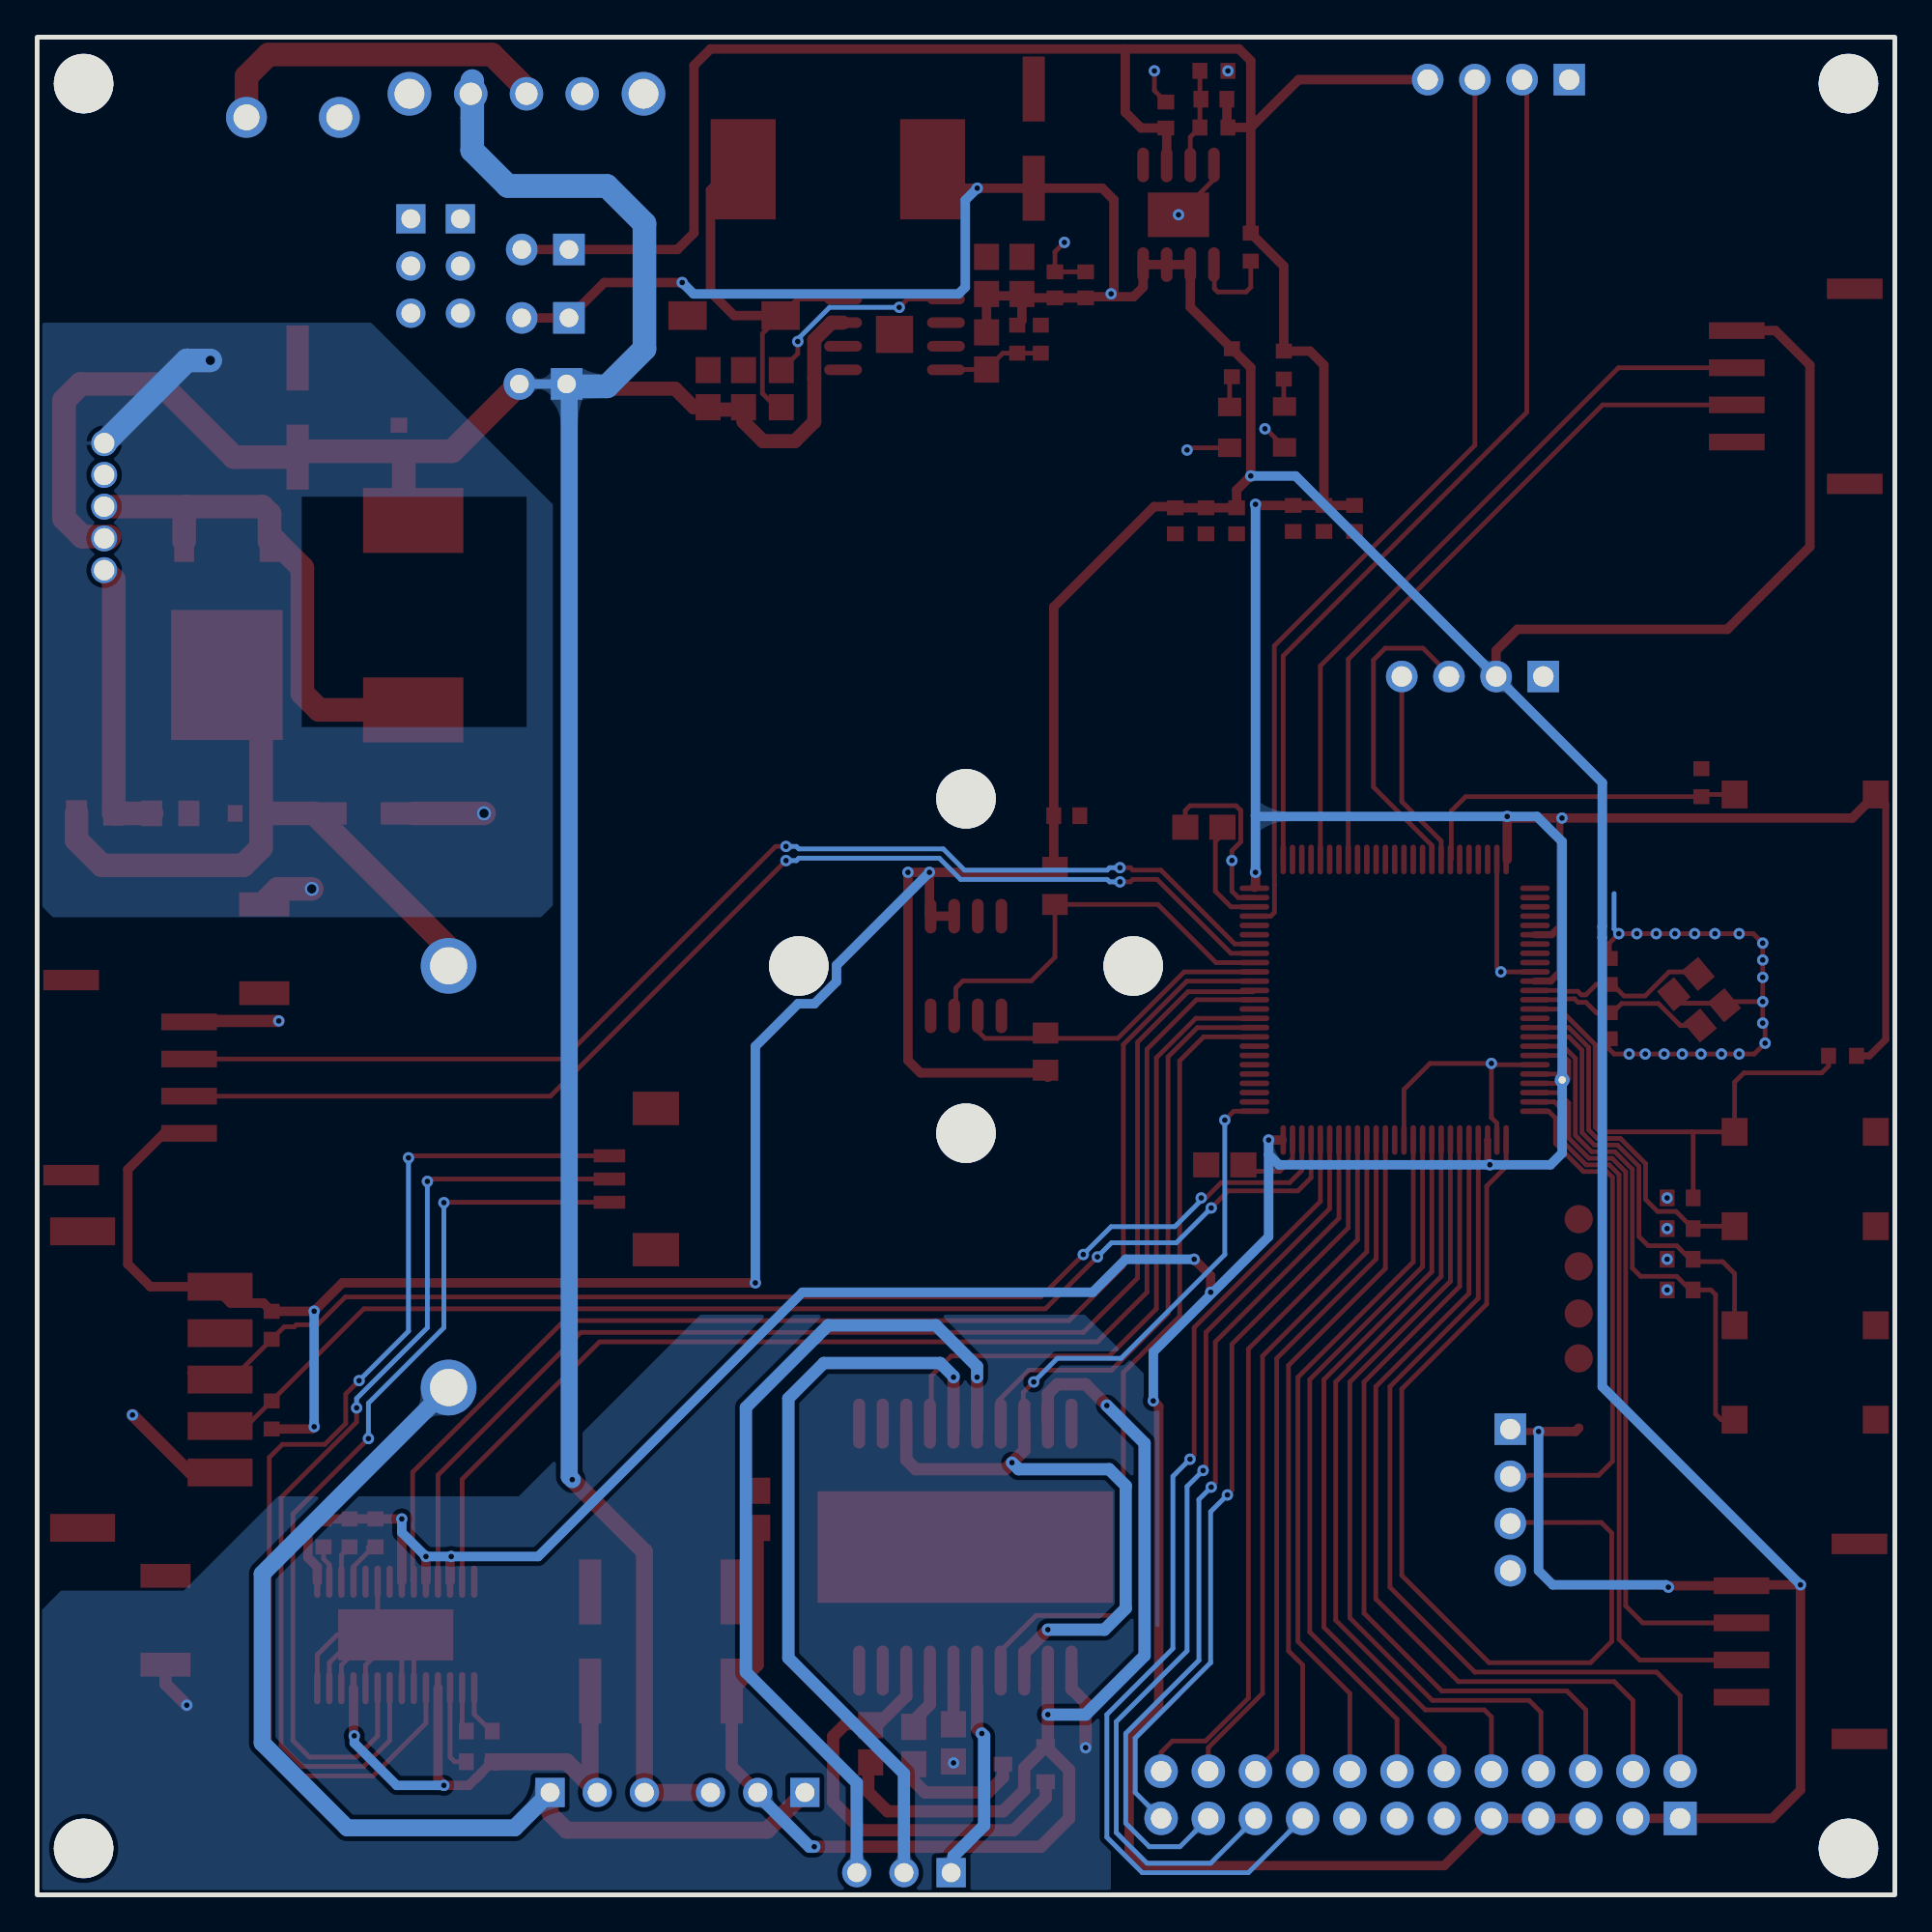
[diagram p3: board, bottom side, seen from below]

Outline 100 x 100 mm; copper layers: Top Layer, Bottom Layer. Coordinates in mm from the lower left corner of the outline.
Outline path: rectangle 0,100 100,0
Stack: Top Layer 0.035mm / Dielectric1 1.51mm FR4 er 4.5 / Bottom Layer 0.035mm

## Design rules (mm)
net PH0-OSC_IN: DP1
net PH1-OSC_OUT: DP1
template: 自定义配置
spacing copperThickness1oz (default): track to track 0.102, other pairs 0.152 to 0.3
spacing copperThickness2oz: track to track 0.203, other pairs 0.152 to 0.3
track width copperThickness1oz (default): min 0.127, default 0.66, max 2.54
track width copperThickness2oz: min 0.203, default 0.254, max 2.54
track width trackWidth1: min 0.127, default 0.254, max 2.54
differential pair differentialPair (default): width min 0.127, default 0.254, max 2.54; gap min 0.152, default 0.152
via viaSize (default): diameter min 0.5, default 0.61, max 10; hole min 0.3, default 0.305, max 6.299

## Placement (name value [footprint] x y rotation side)
BOOT1  K2-1107ST-A4DW-06  [KEY-SMD_L6.2-W3.6-LS8.0]  4.83 59.23 0 top
C1  100nF  [C0603]  11.56 35.86 180 top
C2  100nF  [C0603]  11.56 34.21 180 top
C3  100nF  [C0603]  11.56 32.56 180 top
C6  100nF  [C0603]  44.57 58.09 180 top
C18  18pF  [C0603]  15.37 49.71 270 top
C19  18pF  [C0603]  15.37 46.79 270 top
C20  100nF  [C0603]  11.56 37.52 180 top
C21  2.2U  [C0805]  37.19 57.47 180 top
C22  2.2U  [C0805]  36.07 39.29 180 top
C23  100nF  [C0603]  29.08 74.09 90 top
C24  100nF  [C0603]  30.73 74.09 90 top
C25  100nF  [C0603]  32.38 74.09 90 top
C26  100nF  [C0603]  35.43 73.97 90 top
C27  100nF  [C0603]  37.08 73.97 90 top
C28  100nF  [C0603]  38.74 73.97 90 top
C36  100nF  [C0603]  76.2 8.81 180 top
C37  100nF  [C0603]  76.2 7.16 0 top
C42  100nF  [C0603]  45.21 86.67 270 top
C43  100nF  [C0603]  36.66 96.66 180 top
C48  100uF  [CAP-SMD_BD6.3-L6.6-W6.6-FD]  70.23 13.64 90 top
C49  22UF  [C0805]  61.98 81.08 270 top
C50  4.7UF  [C0805]  63.88 81.08 270 top
C51  10nF  [C0805]  59.94 81.08 90 top
C52  22uF  [C0805]  46.99 87.17 270 top
C53  100nF  [C0805]  48.9 87.17 270 top
C54  82PF  [C0805]  48.9 83.11 90 top
C56  10uF  [C0603]  43.56 86.67 270 top
C57  100nF  [C0603]  39.24 95.81 90 top
C58  220uF  [CAP-SMD_BD6.3-L6.6-W6.6-FD]  46.35 94.54 90 top
C59  100uF  [CAP-SMD_BD6.3-L6.6-W6.6-FD]  85.98 80.06 90 top
C60  1000nF  [C0603]  80.52 78.41 90 top
C61  100uF  [CAP-SMD_BD6.3-L6.6-W6.6-FD]  82.42 58.22 180 top
C62  1000nF  [C0603]  88.64 58.22 0 top
C63  220nF  [C0805]  55.13 8.13 270 top
C64  10nF  [C0805]  52.82 8.04 270 top
C65  1uF  [C0805]  50.67 8.18 270 top
C66  100uF  [CAP-SMD_BD6.3-L6.6-W6.6-FD]  62.61 13.64 90 top
C67  100nF  [C0805]  61.21 20.75 270 top
D1  SS54  [SMA_L4.4-W2.8-LS5.4-R-RD]  62.48 85.01 0 top
D2  MBRD1045  [TO-252-3_L6.5-W5.9-P4.60-LS10.0-BL]  89.79 69.27 180 top
D3  LBAT54SLT1G  [SOT-23_L2.9-W1.3-P1.90-LS2.4-BR]  46.86 7.04 180 top
Debug  -  [HDR-TH_4P-P2.54-V-F]  21.34 97.71 0 top
F1  保险管座(插件),AC250V/10A,脚距23mm,配φ5  [FUSE-TH_L28.8-W10.0_C9900019320]  77.85 38.66 270 top
H2  -  [HDR-TH_3P-P2.54-V-F]  77.22 87.68 270 top
H4  -  [HDR-TH_3P-P2.54-V-F]  79.88 87.68 270 top
H7  -  [HDR-TH_2P-P2.54-V-F]  72.64 84.89 0 top
H8  -  [HDR-TH_2P-P2.54-V-F]  72.77 81.33 0 top
H9  -  [HDR-TH_2P-P2.54-V-F]  72.64 88.57 0 top
H10  -  [HDR-TH_4P-P2.54-V-F]  20.7 21.26 270 top
H11  -  [HDR-TH_3P-P2.54-V-F]  69.85 5.51 180 top
H12  -  [HDR-TH_3P-P2.54-V-F]  61.21 5.51 0 top
H13  -  [HDR-TH_3P-P2.54-V-F]  53.34 1.19 0 top
JY60  -  [JY60]  17.02 28.75 0 top
L1  APCI00121280150MB2-22uH  [IND-SMD_L12.0-W12.0_744771008]  56.9 92.89 180 top
L2  APCI00121280150MB2-22uH  [IND-SMD_L12.0-W12.0_744771008]  79.76 68.89 90 top
LED6  -  [LED_0805]  32.86 79.07 90 top
LED7  -  [LED_0805]  35.81 79.05 90 top
NOREF  -  [Pad_e4324]  17.91 43.87 0 top
oled  -  [HDR-TH_4P-P2.54-V-F]  22.73 65.58 0 top
PC1  K2-1107ST-A4DW-06  [KEY-SMD_L6.2-W3.6-LS8.0]  4.83 35.99 180 top
PC2  K2-1107ST-A4DW-06  [KEY-SMD_L6.2-W3.6-LS8.0]  4.83 30.66 180 top
PC3  K2-1107ST-A4DW-06  [KEY-SMD_L6.2-W3.6-LS8.0]  4.83 25.58 180 top
R17  100K  [R0603]  34.67 88.7 90 top
R18  10K  [R0603]  36.66 98.19 0 top
R19  31K  [R0603]  36.66 95.14 180 top
R23  10K  [R0603]  10.41 59.87 90 top
R24  1K  [R0603]  32.89 82.35 90 top
R28  10K  [R0603]  81.79 19.48 90 top
R29  10K  [R0603]  83.19 19.48 90 top
R30  10K  [R0603]  84.58 19.48 90 top
R38  10K  [R0603]  87.38 30.66 90 top
R39  10K  [R0603]  87.38 25.83 270 top
R42  10K  [R0603]  47.24 83.74 90 top
R43  3.16K  [R0603]  45.97 83.74 270 top
R44  10K  [R0603]  2.81 45.17 0 top
R45  10K  [R0805]  45.72 45.39 90 top
R46  10K  [R0805]  45.21 54.31 270 top
R48  1K  [R0603]  35.69 82.47 90 top
R49  49.9K  [R0805]  96.88 58.24 0 top
R50  2.7K  [R0805]  92.84 58.22 0 top
R52  0K  [R2010]  87.77 50.93 90 top
R54  0K  [R2010]  93.09 14.78 270 top
RSET1  K2-1107ST-A4DW-06  [KEY-SMD_L6.2-W3.6-LS8.0]  4.83 41.07 180 top
SCREW1  -  [M3螺丝]  50 59 0 top
SCREW2  -  [M3螺丝]  59 50 0 top
SCREW3  -  [M3螺丝]  50 41 0 top
SCREW4  -  [M3螺丝]  41 50 0 top
SCREW9  -  [M3螺丝]  97.5 2.5 0 top
SCREW10  -  [M3螺丝]  97.5 97.5 0 top
SCREW11  -  [M3螺丝]  2.5 2.5 0 top
SCREW12  -  [M3螺丝]  2.5 97.5 0 top
SW4  SK-12F14G6  [SW-TH_SK-12F14-G]  73.66 96.95 90 top
U5  STM32F407VET6  [LQFP-100_L14.0-W14.0-P0.50-LS16.0-BL]  26.92 48.18 270 top
U12  KF301-5.0-2P  [CONN-TH_P5.00_KF301-5.0-2P]  86.23 95.68 0 top
U13  DS8570F8  [ESOP-8_L4.9-W3.9-P1.27-LS6.0-BL-EP-1]  38.56 90.44 0 top
U16  DRV8313PWPR  [HTSSOP-28_L9.8-W4.5-P0.65-LS6.6-BL-EP]  80.7 13.99 0 top
U23  RT8289GSP  [SOIC-8_L5.0-W4.0-P1.27-LS6.0-BL-EP2.0]  53.85 84 270 top
U24  MT6701CT-STD  [SOP-8_L4.9-W3.9-P1.27-LS6.0-BL]  50 50 180 top
U26  WAFER-MX1.25-3PWB  [CONN-SMD_3P-P1.25_WAFER-MX1.25-3PWB]  67.94 38.53 270 top
U27  2.54-2*12P弯针  [HDR-TH_24P-P2.54-H-M-R2-C12-S2.54]  25.53 5.38 0 top
U28  XH2.54-5P,卧式  [CONN-SMD_5P-P2.50_XUNPU_WAFER-254W-5P]  93.85 27.74 90 top
U29  XL6012E1  [TO-220-5L_L10.2-W4.5-P1.71-L]  96.39 74.73 270 top
U31  L6234PD013TR  [POWERSO20_L15.9-W11.0-P1.27-LS14.2-BL-EP]  50.04 18.72 180 top
UART1  PH2.0-4P WT  [CONN-SMD_PH2.0-4PWB]  95 43.99 270 top
UART4  PH2.0-4P WT  [CONN-SMD_PH2.0-4PWB]  5.08 13.64 90 top
UART5  PH2.0-4P WT  [CONN-SMD_PH2.0-4PWB]  5.33 81.2 90 top
X2  25MHz  [CRYSTAL-SMD_4P-L3.2-W2.5-BL]  10.54 48.18 50 top

## Footprints (pads in the part's own frame, mm; a bottom-side part is the same pattern mirrored in y, then rotated)
C0603
  rect 0.8x0.9 smd: 1(-0.7,0) 2(0.7,0)
C0805
  rect 1.41x1.35 smd: 1(-1,0) 2(1,0)
CAP-SMD_BD6.3-L6.6-W6.6-FD
  rect 3.5x1.2 smd: 1(-2.67,0) 2(2.67,0)
CONN-SMD_3P-P1.25_WAFER-MX1.25-3PWB
  rect 0.7x1.7 smd: 1(-1.25,1.25) 2(0,1.25) 3(1.25,1.25)
  rect 1.8x2.5 smd: 4(-3.8,-1.25) 5(3.8,-1.25)
CONN-SMD_5P-P2.50_XUNPU_WAFER-254W-5P
  rect 1.5x3.5 smd: 1(-5,3.7) 2(-2.5,3.7) 3(0,3.7) 4(2.5,3.7) 5(5,3.7) 6(-7.98,-3.7) 7(7.98,-3.7)
CONN-SMD_PH2.0-4PWB
  rect 0.9x3 smd: 1(-3,-3.175) 2(-1,-3.175) 3(1,-3.175) 4(3,-3.175)
  rect 1.1x3 smd: 5(5.25,3.175) 6(-5.25,3.175)
CONN-TH_P5.00_KF301-5.0-2P
  round 2.2 hole 1.4: 1(-2.5,0) 2(2.5,0)
CRYSTAL-SMD_4P-L3.2-W2.5-BL
  rect 1.4x1.2 smd: 1(-1.1,-0.85) 2(1.1,-0.85) 3(1.1,0.85) 4(-1.1,0.85)
ESOP-8_L4.9-W3.9-P1.27-LS6.0-BL-EP-1
  oval 0.63x1.865 smd: 1(-1.905,-2.683) 2(-0.635,-2.683) 3(0.635,-2.683) 4(1.905,-2.683) 5(1.905,2.683) 6(0.635,2.683) 7(-0.635,2.683) 8(-1.905,2.683)
  rect 3.3x2.4 smd: 9(0,0)
FUSE-TH_L28.8-W10.0_C9900019320
  round 3 hole 2: 1(-11.35,0) 2(11.35,0)
HDR-TH_2P-P2.54-V-F
  rect 1.7x1.7 hole 1: 1(-1.27,0)
  round 1.7 hole 1: 2(1.27,0)
HDR-TH_3P-P2.54-V-F
  rect 1.575x1.575 hole 1.02: 1(-2.54,0)
  round 1.575 hole 1.02: 2(0,0) 3(2.54,0)
HDR-TH_4P-P2.54-V-F
  rect 1.7x1.7 hole 1.1: 1(-3.81,0)
  round 1.7 hole 1.1: 2(-1.27,0) 3(1.27,0) 4(3.81,0)
HDR-TH_24P-P2.54-H-M-R2-C12-S2.54
  rect 1.778x1.8 hole 1.1: 1(-13.97,-1.27)
  round 1.8 hole 1.1: 2(-13.97,1.27) 3(-11.43,-1.27) 4(-11.43,1.27) 5(-8.89,-1.27) 6(-8.89,1.27) 7(-6.35,-1.27) 8(-6.35,1.27) 9(-3.81,-1.27) 10(-3.81,1.27) 11(-1.27,-1.27) 12(-1.27,1.27) 13(1.27,-1.27) 14(1.27,1.27) 15(3.81,-1.27) 16(3.81,1.27) 17(6.35,-1.27) 18(6.35,1.27) 19(8.89,-1.27) 20(8.89,1.27) 21(11.43,-1.27) 22(11.43,1.27) 23(13.97,-1.27) 24(13.97,1.27)
HTSSOP-28_L9.8-W4.5-P0.65-LS6.6-BL-EP
  oval 0.343x1.732 smd: 1(-4.225,-2.866) 2(-3.575,-2.866) 3(-2.925,-2.866) 4(-2.275,-2.866) 5(-1.625,-2.866) 6(-0.975,-2.866) 7(-0.325,-2.866) 8(0.325,-2.866) 9(0.975,-2.866) 10(1.625,-2.866) 11(2.275,-2.866) 12(2.925,-2.866) 13(3.575,-2.866) 14(4.225,-2.866) 15(4.225,2.866) 16(3.575,2.866) 17(2.925,2.866) 18(2.275,2.866) 19(1.625,2.866) 20(0.975,2.866) 21(0.325,2.866) 22(-0.325,2.866) 23(-0.975,2.866) 24(-1.625,2.866) 25(-2.275,2.866) 26(-2.925,2.866) 27(-3.575,2.866) 28(-4.225,2.866)
  rect 6.2x2.75 smd: 29(0,0)
IND-SMD_L12.0-W12.0_744771008
  rect 3.5x5.4 smd: 1(-5.1,0) 2(5.1,0)
JY60
  round 1.524 smd: 1(0,7.62) 2(0,5.08) 3(0,2.54) 4(0,0.127)
KEY-SMD_L6.2-W3.6-LS8.0
  rect 1.4x1.5 smd: 1(-3.8,0) 2(3.8,0)
LED_0805
  rect 1x1.25 smd: 1(-1.15,0.005) 2(1.05,0.005)
LQFP-100_L14.0-W14.0-P0.50-LS16.0-BL
  oval 0.3x1.6 smd: 1(-6,-7.55) 2(-5.5,-7.55) 3(-5,-7.55) 4(-4.5,-7.55) 5(-4,-7.55) 6(-3.5,-7.55) 7(-3,-7.55) 8(-2.5,-7.55) 9(-2,-7.55) 10(-1.5,-7.55) 11(-1,-7.55) 12(-0.5,-7.55) 13(0,-7.55) 14(0.5,-7.55) 15(1,-7.55) 16(1.5,-7.55) 17(2,-7.55) 18(2.5,-7.55) 19(3,-7.55) 20(3.5,-7.55) 21(4,-7.55) 22(4.5,-7.55) 23(5,-7.55) 24(5.5,-7.55) 25(6,-7.55) 51(6,7.55) 52(5.5,7.55) 53(5,7.55) 54(4.5,7.55) 55(4,7.55) 56(3.5,7.55) 57(3,7.55) 58(2.5,7.55) 59(2,7.55) 60(1.5,7.55) 61(1,7.55) 62(0.5,7.55) 63(0,7.55) 64(-0.5,7.55) 65(-1,7.55) 66(-1.5,7.55) 67(-2,7.55) 68(-2.5,7.55) 69(-3,7.55) 70(-3.5,7.55) 71(-4,7.55) 72(-4.5,7.55) 73(-5,7.55) 74(-5.5,7.55) 75(-6,7.55)
  oval 1.6x0.3 smd: 26(7.55,-6) 27(7.55,-5.5) 28(7.55,-5) 29(7.55,-4.5) 30(7.55,-4) 31(7.55,-3.5) 32(7.55,-3) 33(7.55,-2.5) 34(7.55,-2) 35(7.55,-1.5) 36(7.55,-1) 37(7.55,-0.5) 38(7.55,0) 39(7.55,0.5) 40(7.55,1) 41(7.55,1.5) 42(7.55,2) 43(7.55,2.5) 44(7.55,3) 45(7.55,3.5) 46(7.55,4) 47(7.55,4.5) 48(7.55,5) 49(7.55,5.5) 50(7.55,6) 76(-7.55,6) 77(-7.55,5.5) 78(-7.55,5) 79(-7.55,4.5) 80(-7.55,4) 81(-7.55,3.5) 82(-7.55,3) 83(-7.55,2.5) 84(-7.55,2) 85(-7.55,1.5) 86(-7.55,1) 87(-7.55,0.5) 88(-7.55,0) 89(-7.55,-0.5) 90(-7.55,-1) 91(-7.55,-1.5) 92(-7.55,-2) 93(-7.55,-2.5) 94(-7.55,-3) 95(-7.55,-3.5) 96(-7.55,-4) 97(-7.55,-4.5) 98(-7.55,-5) 99(-7.55,-5.5) 100(-7.55,-6)
M3螺丝
  round 3.2 hole 3.2: 1(0,0)
Pad_e4324
  round 0.8 hole 0.4: 1(0,0)
POWERSO20_L15.9-W11.0-P1.27-LS14.2-BL-EP
  oval 0.651x2.696 smd: 1(-5.715,-6.647) 2(-4.445,-6.647) 3(-3.175,-6.647) 4(-1.905,-6.647) 5(-0.635,-6.647) 6(0.635,-6.647) 7(1.905,-6.647) 8(3.175,-6.647) 9(4.445,-6.647) 10(5.715,-6.647) 11(5.715,6.647) 12(4.445,6.647) 13(3.175,6.647) 14(1.905,6.647) 15(0.635,6.647) 16(-0.635,6.647) 17(-1.905,6.647) 18(-3.175,6.647) 19(-4.445,6.647) 20(-5.715,6.647)
  rect 15.9x6 smd: 21(0,0)
R0603
  rect 0.806x0.864 smd: 1(-0.753,0) 2(0.753,0)
R0805
  rect 1.133x1.377 smd: 1(-1,0) 2(1,0)
R2010
  rect 1.282x2.7 smd: 1(-2.391,0) 2(2.391,0)
SMA_L4.4-W2.8-LS5.4-R-RD
  rect 2.062x1.539 smd: 1(2.503,0) 2(-2.503,0)
SOIC-8_L5.0-W4.0-P1.27-LS6.0-BL-EP2.0
  oval 0.574x2.038 smd: 1(-1.905,-2.769) 2(-0.635,-2.769) 3(0.635,-2.769) 4(1.905,-2.769) 5(1.905,2.769) 6(0.635,2.769) 7(-0.635,2.769) 8(-1.905,2.769)
  rect 2x2 smd: 9(0,0)
SOP-8_L4.9-W3.9-P1.27-LS6.0-BL
  oval 0.63x1.865 smd: 1(-1.905,-2.683) 2(-0.635,-2.683) 3(0.635,-2.683) 4(1.905,-2.683) 5(1.905,2.683) 6(0.635,2.683) 7(-0.635,2.683) 8(-1.905,2.683)
SOT-23_L2.9-W1.3-P1.90-LS2.4-BR
  rect 1x0.8 smd: 1(1.15,-0.95) 2(1.15,0.95) 3(-1.15,0)
SW-TH_SK-12F14-G
  round 1.8 hole 1.2: 1(0,0) 2(0,-3) 3(0,3)
  round 2.35 hole 1.6: 4(0,-6.3) 5(0,6.3)
TO-220-5L_L10.2-W4.5-P1.71-L
  round 1.4 hole 1.1: 1(-3.42,0) 2(-1.71,0) 3(0,0) 4(1.71,0) 5(3.42,0)
TO-252-3_L6.5-W5.9-P4.60-LS10.0-BL
  rect 1.064x2.219 smd: 1(-2.3,-3.599) 3(2.3,-3.599)
  rect 6x7 smd: 2(0,3.599)

## Nets
As in the schematic, except:
+3.3V: BOOT1.1 C23.2 C24.2 C25.2 C43.2 C57.1 Debug.4 H9.1 H9.2 NOREF.1 R17.2 R19.2 R24.2 R28.2 R29.2 R30.2 R44.1 U5.6 U5.11 U5.19 U5.21 U5.22 U5.28 U5.50 U5.75 U5.100 U13.6 U16.15 U16.22 U16.24 U16.26 U27.5 U27.7 U27.9

Pads without a net: SCREW1 1; SCREW2 1; SCREW3 1; SCREW4 1; SCREW9 1; SCREW10 1; SCREW11 1; SCREW12 1; SW4 3 4 5; U5 1 2 3 4 5 7 8 9 15 38 52 53 54 55 56 57 58 62 70 71 77 78 79 81 82 84 85 86 87 88 89 90 91 95 96 97 98; U13 5; U16 19 21; U23 2 3 5; U24 3 5 8; U26 4 5; U28 4 6 7; U29 2; UART1 5 6; UART4 5 6; UART5 5 6

## Via types
v1: diameter 0.61, hole 0.305, Top Layer to Bottom Layer, 95 vias
v2: diameter 0.762, hole 0.508, Top Layer to Bottom Layer, 2 vias
v3: diameter 0.914, hole 0.508, Top Layer to Bottom Layer, 1 via

## Routing (per net, layer and track width the routed paths; a pad name or vN(x,y) marks a point on that pad's centre or on a via; arc(x,y) is an arc through that point)
+3.3V: length 365.9
  Top Layer w0.254: 17.72,44.18 U5.21 ; U5.22 17.79,43.68 17.55,43.92 17.55,44.88 17.86,45.18 U5.19
  Top Layer w0.381: U5.11 19.37,49.19 18.52,49.19 18.03,49.68 18.03,52.12 ; 18.03,52.12 18.03,57.85 v1(17.92,57.96) ; 18.03,52.12 18.47,51.68 U5.6 ; v1(21.8,39.3) 21.92,39.41 21.92,40.63 U5.28 ; BOOT1.1 0.49,58.7 0.49,46.04 1.37,45.17 R44.1
  Top Layer w0.508: 41.43,99.37 63.75,99.37 64.64,98.48 64.64,89.46 65.53,88.57 H9.1 H9.2 ; 41.43,99.37 41.43,95.96 40.57,95.11 C57.1 39.2,95.06 U13.6 ; 41.43,99.37 35.31,99.37 34.67,98.73 34.67,95.14 ; C43.2 35.96,95.19 R19.2 34.67,95.14 ; Debug.4 32.09,97.71 34.67,95.14 ; 34.67,95.14 R17.2 32.89,87.67 R24.2 31.49,83.1 30.73,82.35 C24.2 ; C24.2 C25.2 34.35,74.79 v1(34.42,74.85) ; C24.2 C23.2 ; U16.15 84.92,17.66 85.42,18.16 85.42,19.66 84.84,20.24 R30.2 R29.2 R28.2 v1(80.37,20.24) U16.22 ; v1(34.42,55.04) 34.42,54.3 34.47,54.24 ; v1(36.83,32.44) 36.83,33.33 v1(37.72,34.21) ; v1(33.71,40.63) 32.98,40.63 ; 16.64,4.12 21.72,4.12 24.26,1.57 40.55,1.57 41.21,2.24 41.21,8.49 39.62,10.08 39.62,26.3 v1(39.92,26.59) ; 20.87,55.73 v1(20.87,58.05) 20.78,57.96 v1(17.92,57.96) 2.3,57.96 BOOT1.1 ; U16.26 77.77,18.15 v1(77.71,18.21) ; U16.24 v1(79.07,18.21)
  Bottom Layer w0.508: 34.42,58.08 v1(34.42,55.04) ; 34.42,58.08 v1(34.42,74.85) ; 34.42,58.08 34.39,58.05 v1(20.87,58.05) 19.26,58.05 17.91,56.69 NOREF.1 17.91,39.93 18.54,39.3 v1(21.8,39.3) 33.15,39.3 33.71,39.86 ; v1(39.92,26.59) 39.92,29.22 33.71,35.43 33.71,39.86 ; v1(37.72,34.21) 41.4,34.21 43.18,32.44 58.81,32.44 73.03,18.21 v1(77.71,18.21) v1(79.07,18.21) 80.37,19.51 v1(80.37,20.24) ; 33.71,39.86 v1(33.71,40.63)
+5V: length 368.4
  Top Layer w0.381: v1(19.18,24.94) 20.7,24.94
  Top Layer w0.508: v1(85.09,25.2) 85.21,25.08 R39.2 ; C54.2 C53.2 48.8,86.07 47.09,86.07 C52.2 ; 42.04,86.18 42.04,91.24 42.67,91.87 C58.1 v1(49.39,91.87) 50.78,91.87 L1.2 ; 90.47,32.74 93.9,32.74 95.12,33.96 95.12,39.04 93.17,40.99 UART1.4 ; 90.47,32.74 89.59,31.85 87.82,31.85 R38.2 85.1,31.41 v1(85.09,31.42) 83.57,32.94 v1(61.34,32.94) ; 90.47,32.74 90.15,32.74 ; v1(12.19,16.56) 12.11,16.64 UART4.4 8.21,16.69 v1(5.08,16.69) 5.08,5.64 6.6,4.12 14.1,4.12 ; v1(19.18,24.94) 17.2,24.94 17.02,25.12 ; oled.2 21.46,66.98 20.32,68.12 9.02,68.12 4.57,72.57 4.57,82.35 6.43,84.2 UART5.4 ; C52.2 46.99,84.75 R42.2 ; C52.2 46.78,85.97 C42.2 C56.2 43.5,86.03 42.19,86.03 ; v1(51.97,55.04) 45.48,55.04 R46.1 45.27,55.37 C6.1 45.27,69.33 39.88,74.73 38.8,74.73 C28.2 C27.2 C26.2 35.43,75.62 v1(34.67,76.38) 34.67,82.21 R48.2 37.93,85.47 U13.2 U13.3 U13.4 40.47,86.54 40.97,86.03 42.19,86.03 ; v1(51.97,55.04) v1(53.12,55.04) 53.12,44.92 52.45,44.25 45.83,44.25 45.59,44.01 ; v1(51.97,55.04) 51.97,52.75 U24.1 U24.2 ; 42.19,86.03 42.04,86.18 ; v1(65.28,86.79) 69.47,86.79 H7.1 H7.2
  Bottom Layer w0.508: v1(65.28,86.79) 64.66,86.18 50.4,86.18 50.04,86.54 50.04,91.23 v1(49.39,91.87) ; v1(34.67,76.38) 32.26,76.38 oled.2 15.75,59.87 15.75,52.14 15.76,52.13 15.76,51.53 15.75,51.52 15.75,27.36 v1(5.08,16.69) ; v1(51.97,55.04) 56.97,50.04 56.97,49.16 58.16,47.97 59.04,47.97 61.34,45.67 v1(61.34,32.94) ; v1(12.19,16.56) 12.32,16.69 18.42,16.69 19.18,17.45 v1(19.18,24.94) ; v1(85.09,25.2) v1(85.09,31.42)
  vias: v1(42.19,86.18)
+12V: length 173.4
  Top Layer w0.762: H8.1 71.25,81.08 65.66,81.08 64.66,80.08 C50.2 63.75,79.95 62.1,79.95 C49.2 61.98,79.3 60.93,78.25 59.21,78.25 58.17,79.3 58.17,81.62 58.17,81.63 58.17,83.7 57.24,84.63 56.62,84.63
  Top Layer w0.914: v1(71.2,22.35) 67.31,18.47 H11.3 63.63,5.51
  Top Layer w1.27: H8.2 77.66,77.71 C60.1 ; C60.1 85.66,77.71 C59.1 89.41,77.39 93.34,81.33 97.66,81.33 98.55,80.44 98.55,74.09 97.57,73.11 96.1,73.11 96.2,73.02 96.39,73.02 ; C60.1 80.26,77.46 80.26,74.11
  Bottom Layer w0.508: H8.1 H8.2
  Bottom Layer w0.914: v1(71.2,22.35) 71.36,22.51 71.36,81.19
  Bottom Layer w1.27: 76.58,97.63 76.58,93.9 74.67,91.99 69.33,91.99 67.31,89.97 67.31,83.22 69.32,81.2 71.37,81.2 H8.1
+24V: length 57.5
  Top Layer w0.914: H12.1 60.71,3.48 71.5,3.48 72.39,4.37 H11.1
  Bottom Layer w0.914: F1.2 87.88,17.28 87.88,8.18 83.31,3.61 74.29,3.61 H11.1
AGND: length 30.7
  Top Layer w0.254: U16.10 82.32,12.37 U16.29 81.67,14.97 U16.20 ; 82,13.99 83.62,12.37 U16.12 ; U16.6 79.72,13.02 80.37,13.67 U16.7 ; U16.14 84.92,12.92 83.85,13.99 82.78,13.99 84.27,12.5 U16.13
  Top Layer w0.66: U31.11 44.32,11.1 43.56,10.34 v1(43.56,7.93) ; v1(91.95,10.21) 93.09,11.35 R54.2
  vias: v1(50.67,7.1)
GND: length 88.3
  Top Layer w0.254: 9.58,48 11.42,48 X2.2 ; 9.58,48 9.29,48 X2.4 ; 9.58,48 9.69,47.89 ; 9.58,48 9.5,48.08 v1(7.11,48.08) ; U5.99 21.42,49.9 v1(21.21,49.68) U5.10 ; v1(33.91,78.92) 33.85,78.92 32.85,77.92 ; U13.8 36.66,92.34 v1(38.56,90.44) ; U5.20 21.65,44.68 v1(21.72,44.75) ; v1(21.72,44.75) 21.72,41.83 21.42,41.54 U5.27 ; v1(21.72,44.75) 25.02,44.75 26.42,43.35 U5.37 ; LED7.1 37.98,77.89 v1(38.1,77.78) ; v1(7.11,48.08) v1(7.11,49.39) v1(7.11,50.32) v1(7.11,51.23) 7.62,51.74 v1(8.38,51.74) v1(9.69,51.74) v1(10.78,51.74) v1(11.84,51.74) v1(12.84,51.74) v1(13.89,51.74) v1(14.86,51.74) 15.37,51.23 C18.1 ; v1(7.11,48.08) v1(7.11,46.93) 6.98,46.8 v1(6.98,45.85) 7.57,45.26 v1(8.38,45.26) v1(9.33,45.26) v1(10.43,45.26) v1(11.44,45.26) v1(12.42,45.26) v1(13.44,45.26) v1(14.3,45.26) 15.11,45.26 15.42,45.57 15.42,46.03 C19.2 ; C57.2 39.86,97.12 v1(39.86,98.19) ; v1(44.7,88.95) 45.21,88.44 45.21,87.36 43.56,87.36 ; U5.74 35.34,53.68 35.69,54.03 v1(35.69,55.68) 35.69,56.2 35.21,56.68 35.21,58.38 35.46,58.63 37.94,58.63 38.19,58.38 C21.1
  Top Layer w0.66: v1(87,47.04) 91.77,47.04 UART1.1 ; v1(94.87,25.83) 91.77,22.74 90.15,22.74
  Bottom Layer w0.254: 15.11,53.9 15.11,51.99 v1(14.86,51.74)
  vias: v1(12.26,37.52) v1(12.26,35.86) v1(12.26,34.21) v1(12.26,32.56) v1(35.9,98.19)
VIN: length 81.1
  Top Layer w0.66: 45.59,25.37 45.59,26.97 45.09,27.48 43.56,27.48 v1(42.42,26.34) ; 55.26,6.5 55.26,5.54 54.22,4.5 48.01,4.5 46.86,5.64 46.86,6.84 D3.1 ; D3.1 44.45,6.72 44.45,4.12 45.97,2.59 v1(58.17,2.59) ; D3.1 45.59,8.11 45.59,11.18 ; C67.2 61.21,12.37 C66.1 62.61,6.91 H12.2
  Bottom Layer w0.66: H12.2 61.21,5.38 58.42,2.59 v1(58.17,2.59) ; v1(45.59,9.7) 43.56,9.7 40.39,12.88 40.39,24.31 v1(42.42,26.34)
BOOT0: length 18.2
  Top Layer w0.254: U5.94 23.88,55.78 23.88,58.34 23.11,59.11 R23.1 10.3,59.23 BOOT1.2
CLK: length 47.5
  Top Layer w0.254: Debug.2 19.81,97.46 19.81,79.81 32.92,66.69 U5.76
DIO: length 50.5
  Top Layer w0.254: Debug.3 22.61,78.03 33.4,67.23 33.4,54.88 33.4,54.88 33.4,54.36 33.39,54.36 33.39,52.89 33.6,52.68 U5.72
EN: length 55.7
  Top Layer w0.254: v1(46.35,27.61) 46.92,27.05 46.92,25.42 U31.8 ; U5.51 35.59,42.18 v1(36.07,41.71)
  Top Layer w0.66: 53.21,25.37 53.21,23.42 52.71,22.91 47.88,22.91 v1(47.52,23.27) 46.86,23.93 U31.8 ; v1(45.59,14.28) 46.86,13 U31.13
  Bottom Layer w0.254: v1(46.35,27.61) 45.09,28.88 41.66,28.88 36.07,34.47 v1(36.07,41.71)
  Bottom Layer w0.66: v1(47.52,23.27) 47.17,22.91 42.29,22.91 41.4,22.02 41.4,15.42 42.54,14.28 v1(45.59,14.28)
FB: length 5.5
  Top Layer w0.254: U23.4 51.06,82.11 C54.1 48.01,82.99 R42.1 R43.2
FLT1: length 2.2
  Top Layer w0.254: U16.18 82.97,17.66 82.17,18.47 82.17,18.73
I2C1_SCL: length 17.1
  Top Layer w0.254: U5.92 24.92,56.49 28.07,59.63 28.07,66.47 27.43,67.11 25.4,67.11 24,65.71 oled.3
I2C1_SDA: length 10.7
  Top Layer w0.254: U5.93 24.42,56.73 26.54,58.85 oled.4
I2C2_SCL: length 67.6
  Top Layer w0.254: 91.49,25.32 88.64,25.32 R39.1 82.41,31.55 45.72,31.55 v1(42.93,34.34) ; U5.47 31.42,38.6 32.13,37.9 35.88,37.9 v1(36.8,36.98)
  Bottom Layer w0.254: v1(42.93,34.34) 42.16,35.1 38.67,35.1 v1(36.8,36.98)
I2C2_SDA: length 66.1
  Top Layer w0.254: U5.48 31.92,38.99 32.58,38.34 36.26,38.34 37.09,37.52 v1(37.34,37.52) ; 91.8,28.12 89.16,28.12 R38.1 86.7,30.58 86.15,30.58 86.05,30.69 84.9,30.69 83.41,32.18 45.97,32.18 v1(43.69,34.47)
  Bottom Layer w0.254: v1(43.69,34.47) 42.19,35.97 38.76,35.97 37.34,37.39 v1(37.34,37.52)
I2C3_SCL: length 22.4
  Top Layer w0.254: U5.67 36.54,50.18 39.67,53.31 R46.2 45.21,50.47 46.48,49.2 50.16,49.2 50.55,48.82 50.55,47.41 U24.7
I2C3_SDA: length 17.4
  Top Layer w0.254: U24.6 49.37,46.5 48.98,46.11 41.83,46.11 38.25,49.68 U5.66
KEY1: length 19
  Top Layer w0.254: U5.16 17.55,46.68 16.48,45.62 16.48,41.18 16.02,40.72 14.78,40.72 13.42,39.36 13.42,37.43 12.77,36.79 11.78,36.79 C1.2 10.73,35.99 PC1.1
KEY2: length 23.6
  Top Layer w0.254: U5.17 17.55,46.18 16.84,45.48 16.84,41.03 16.17,40.36 14.92,40.36 13.78,39.21 13.78,35.44 13.28,34.94 11.74,34.94 11.01,34.21 C2.2 10.73,34.09 9.27,34.09 8.63,33.44 PC2.1
KEY3: length 28.4
  Top Layer w0.254: PC3.1 9.35,25.58 9.65,25.88 9.65,32.31 9.91,32.56 C3.2 11.01,32.56 11.74,33.29 13.68,33.29 14.13,33.74 14.13,39.07 15.07,40 16.32,40 17.2,40.88 17.2,45.03 17.85,45.68 U5.18
NRST: length 28.3
  Top Layer w0.254: C20.2 10.86,41 10.93,41.07 ; R44.2 3.57,44.62 3.94,44.25 8.13,44.25 8.63,43.75 RSET1.1 10.93,41.07 ; 10.93,41.07 15.88,41.07 16.13,41.33 16.13,45.77 18.03,47.68 19.37,47.68 U5.14
OUT1: length 46.2
  Top Layer w0.66: 49.4,24.99 v1(49.4,27.86)
  Bottom Layer w0.66: H13.3 55.88,6.02 61.85,11.99 61.85,26.23 57.42,30.66 51.62,30.66 49.4,28.44 v1(49.4,27.86)
OUT2: length 41
  Top Layer w0.66: 50.67,24.99 v1(50.67,27.86)
  Bottom Layer w0.66: v1(50.67,27.86) 50.67,27.91 51.38,28.63 57.66,28.63 59.56,26.72 59.56,12.75 53.34,6.53 H13.2
OUT3: length 10.9
  Top Layer w0.66: 49.4,11.18 49.4,8.94 v1(49.15,8.69)
  Bottom Layer w0.66: H13.1 50.67,1.32 50.67,2.08 49.02,3.73 49.02,8.56 v1(49.15,8.69)
PA4: length 48.1
  Top Layer w0.254: U27.2 11.56,10.72 12.83,11.99 22.61,11.99 27.18,16.56 27.18,27.36 22.42,32.11 U5.29
PA5: length 46.7
  Top Layer w0.254: U5.30 22.92,32.37 27.94,27.36 27.94,15.93 23.5,11.48 15.11,11.48 14.1,10.47 14.1,6.66
PA6: length 45
  Top Layer w0.254: U5.31 23.42,32.76 28.57,27.6 28.57,15.16 24.38,10.97 17.65,10.97 16.64,9.96 U27.6
PA7: length 43.6
  Top Layer w0.254: U27.8 19.05,6.78 19.05,9.83 19.69,10.47 24.89,10.47 29.34,14.91 29.34,27.61 23.92,33.02 U5.32
PB0: length 38.4
  Top Layer w0.254: U27.14 26.8,9.45 31.5,14.15 31.5,27.74 25.42,33.81 U5.35
PB1: length 37.7
  Top Layer w0.254: U27.16 29.34,10.85 32.13,13.64 32.13,27.86 25.92,34.07 U5.36
PC4: length 41.7
  Top Layer w0.254: U27.10 21.72,9.58 22.1,9.96 25.27,9.96 30.1,14.78 30.1,27.61 24.42,33.28 U5.33
PC5: length 39.1
  Top Layer w0.254: U27.12 24.26,7.93 30.73,14.4 30.73,27.74 24.92,33.55 U5.34
PE8: length 36.5
  Top Layer w0.254: U27.18 31.88,12.37 32.64,13.13 32.64,28.5 27.42,33.71 U5.39
PE9: length 36.7
  Top Layer w0.254: U27.20 33.27,7.8 33.27,28.88 27.92,34.23 U5.40
PE10: length 37.5
  Top Layer w0.254: U5.41 28.42,34.62 34.04,29.01 34.04,10.85 36.96,7.93 U27.22
PE11: length 39.4
  Top Layer w0.254: U5.42 28.92,35.26 34.8,29.39 34.8,10.59 37.1,8.28 38.89,8.28 39.5,7.67 U27.24
PE12: length 41.8
  Top Layer w0.254: U5.43 29.42,35.91 35.69,29.64 35.69,21.77 v1(35.93,21.53)
  Bottom Layer w0.254: 39.5,4.12 40.89,5.51 40.89,8.43 36.83,12.5 36.83,20.62 v1(35.93,21.53)
PE13: length 47.1
  Top Layer w0.254: v1(36.8,21.95) 36.58,22.17 36.58,29.77 29.92,36.42 U5.44
  Bottom Layer w0.254: 36.96,4.12 38.48,2.59 40.13,2.59 41.4,3.86 41.4,8.69 37.47,12.62 37.47,21.28 v1(36.8,21.95)
PE14: length 51.2
  Top Layer w0.254: U5.45 30.42,36.94 37.08,30.28 37.08,23 v1(37.24,22.84)
  Bottom Layer w0.254: 34.42,4.12 36.83,1.7 40.26,1.7 41.91,3.35 41.91,9.32 38.1,13.13 38.1,21.98 v1(37.24,22.84)
PE15: length 54.8
  Top Layer w0.254: v1(37.94,23.45) 37.72,23.67 37.72,30.53 30.92,37.33 U5.46
  Bottom Layer w0.254: 31.88,4.12 34.8,1.19 40.51,1.19 42.42,3.1 42.42,9.7 38.86,13.26 38.86,22.53 v1(37.94,23.45)
PH0-OSC_IN: length 9.4
  Top Layer w0.254: 18.87,48.68 17.81,48.68 17.77,48.64 17.07,48.64 16.88,48.45 16.63,48.45 16.07,49.01 C18.2 15.2,49.01 14.58,48.39 13.45,48.39 12.15,49.68 10.7,49.68 10.6,49.57
PH1-OSC_OUT: length 9.4
  Top Layer w0.254: 10.48,46.8 11.54,46.8 12.73,47.98 14.7,47.98 15.2,47.49 C19.1 16.07,47.49 16.63,48.04 17.05,48.04 17.24,48.23 17.77,48.23 17.81,48.18 18.87,48.18
RES1: length 2
  Top Layer w0.254: R30.1 84.58,18.09 84.27,17.78 U16.16
SLP1: length 2.1
  Top Layer w0.254: U16.17 83.62,18.29 R29.1
TIM3_PWM_CH1: length 66.5
  Top Layer w0.254: U16.27 77.12,22.37 69.72,29.77 42.93,29.77 40.26,32.44 40.26,45.52 37.59,48.18 U5.63
TIM3_PWM_CH2: length 67.9
  Top Layer w0.254: U16.25 78.42,22.6 70.74,30.28 43.69,30.28 40.77,33.2 40.77,45.9 38.05,48.61 34.54,48.61 U5.64
TIM3_PWM_CH3: length 69.2
  Top Layer w0.254: U16.23 79.79,16.92 79.79,22.75 71.63,30.91 44.45,30.91 41.53,33.83 41.53,45.77 38.12,49.18 U5.65
TIM4_PWM_CH1: length 44.9
  Top Layer w0.254: 48.13,11.18 48.13,13.13 46.23,15.04 41.78,15.04 41.53,15.29 41.53,28.12 38.5,31.15 38.5,44.9 37.21,46.18 U5.59
TIM4_PWM_CH2: length 32.4
  Top Layer w0.254: 48.13,24.48 48.26,24.61 48.26,26.59 46.61,28.25 42.16,28.25 39.12,31.28 39.12,45.11 37.54,46.68 U5.60
TIM4_PWM_CH3: length 36.8
  Top Layer w0.254: U5.61 37.62,47.18 39.75,45.06 39.75,31.55 42.29,29.01 50.8,29.01 51.87,27.94 51.87,24.55 51.94,24.48
UART1_RX: length 64.4
  Top Layer w0.254: UART1.2 71.69,44.99 60.25,56.44 v1(59.69,56.44) ; U5.69 35.53,51.18 39.5,55.16 41.02,55.16 41.15,55.29 v1(41.71,55.29)
  Bottom Layer w0.254: v1(59.69,56.44) 59.13,56.44 59,56.3 51.23,56.3 50.09,55.16 42.4,55.16 42.27,55.29 v1(41.71,55.29)
UART1_TX: length 64.9
  Top Layer w0.254: v1(59.69,55.67) 72.37,42.99 UART1.3 ; U5.68 35.74,50.68 39.71,54.66 41.02,54.66 41.15,54.53 v1(41.71,54.53)
  Bottom Layer w0.254: v1(41.71,54.53) 42.27,54.53 42.4,54.66 50.29,54.66 51.44,55.8 59,55.8 59.13,55.67 v1(59.69,55.67)
UART2_RX: length 51.1
  Top Layer w0.254: U5.26 20.92,39.2 21.97,38.15 21.97,31.8 26.54,27.23 26.54,17.2 21.84,12.5 16.38,12.5 15.24,13.64 15.24,19.48 15.8,20.04 20.52,20.04 20.7,19.86
UART2_TX: length 27.6
  Top Layer w0.254: 20.7,22.4 19.94,22.4 19.76,22.58 15.95,22.58 15.2,23.33 15.2,38.62 15.51,38.94 16.76,38.94 18.27,40.44 18.27,41.81 18.64,42.18 U5.25
UART4_RX: length 39.2
  Top Layer w0.254: UART4.2 13.73,12.64 14.84,13.75 14.84,38.77 15.36,39.29 16.61,39.29 17.91,40.59 17.91,42.27 18.32,42.68 U5.24
UART4_TX: length 37.7
  Top Layer w0.254: U5.23 18.11,43.18 17.55,42.62 17.55,40.74 16.47,39.65 15.22,39.65 14.49,38.92 14.49,15.56 13.57,14.64 UART4.3
UART5_RX: length 37.4
  Top Layer w0.254: UART5.2 15.73,80.2 29.42,66.51 U5.83
UART5_TX: length 39.5
  Top Layer w0.254: UART5.3 14.88,82.2 30.92,66.16 U5.80
$1N7351: length 6.2
  Top Layer w0.254: U5.73 35.73,53.18 36.58,54.03 36.58,56.71 35.81,57.47
$1N7352: length 4.1
  Top Layer w0.254: U5.49 32.42,39.64 33.11,38.95 34.72,38.95 C22.2
$1N7359: length 1.5
  Top Layer w0.254: R24.1 32.89,80.16 LED6.2
$1N7616: length 10.9
  Top Layer w0.254: v1(59.06,83.62) 59.06,82.97 C51.2 ; U23.1 53.15,85.9 v1(53.59,85.45)
  Bottom Layer w0.254: v1(59.06,83.62) 59.06,83.74 57.34,85.45 v1(53.59,85.45)
$1N7617: length 21.9
  Top Layer w0.254: 56.62,85.9 59.09,85.9 D1.2 60.96,84.03 60.96,80.82 60.21,80.08 C51.1
  Top Layer w0.508: 62,93.52 63.75,91.77 63.75,86.28 62.48,85.01 D1.2
$1N7627: length 18.8
  Top Layer w1.27: U12.2 88.73,97.88 87.55,99.07 75.52,99.07 73.66,97.21 SW4.1
$1N10476: length 4.8
  Top Layer w0.254: R17.1 34.67,86.54 34.93,86.28 36.45,86.28 36.63,86.46 36.63,87.73 U13.1
$1N10481: length 5.3
  Top Layer w0.254: R18.2 R19.1 37.93,94.62 U13.7
$1N13161: length 1.7
  Top Layer w0.254: R48.1 35.81,81.6 LED7.2
$2N858: length 2.8
  Top Layer w0.254: U16.1 76.47,9.72 75.56,8.81 C36.2
$2N859: length 2.4
  Top Layer w0.254: U16.2 77.12,9.04 C36.1
$2N860: length 4.7
  Top Layer w0.254: C37.2 77.52,7.16 77.77,7.42 U16.3
$2N861: length 28.7
  Top Layer w0.508: 78.06,5.89 76.77,5.89 76.36,6.31 76.33,6.31 76.09,6.54 76.09,6.57 C37.1 ; 78.06,5.89 78.42,6.25 U16.4 ; 78.06,5.89 v1(78.1,5.89) ; U16.11 82.97,8.6 v1(82.93,8.56)
  Top Layer w0.914: 70.23,5.89 H11.2 ; 70.23,5.89 71.5,7.16 C37.1 ; 70.23,5.89 C48.1
  Bottom Layer w0.508: v1(78.1,5.89) 80.65,5.89 82.93,8.18 v1(82.93,8.56)
$2N862: length 59.2
  Top Layer w0.254: v1(82.67,27.68) 83.39,26.96 83.39,25.38 84.51,24.25 86.8,24.25 87.5,23.55 87.5,7.8 86.11,6.4 81.91,6.4 79.07,9.24 U16.5 ; v1(80.01,39.67) 79.9,39.78 U26.1
  Bottom Layer w0.254: v1(80.01,39.67) 80.01,30.34 v1(82.67,27.68)
$2N863: length 53.2
  Top Layer w0.254: U16.8 81.03,11.12 81.03,8.31 82.42,6.91 85.72,6.91 86.87,8.05 86.87,21.39 82.8,25.45 v1(82.8,26.21) ; v1(78.99,38.41) 78.87,38.53 U26.2
  Bottom Layer w0.254: v1(78.99,38.41) 78.99,30.53 82.8,26.72 v1(82.8,26.21)
$2N864: length 49.2
  Top Layer w0.254: U26.3 78.09,37.28 v1(78.1,37.26) ; U16.9 81.67,8.55 82.8,7.42 85.34,7.42 86.23,8.31 86.23,20.5 v1(82.17,24.56)
  Bottom Layer w0.254: v1(82.17,24.56) 82.17,26.47 78.1,30.53 v1(78.1,37.26)
$2N3678: length 14.2
  Top Layer w1.27: C61.2 v2(75.95,58.22) ; v2(85.22,54.15) 87.04,54.15 87.77,53.42
  Bottom Layer w1.27: U29.1 91.94,82.6 v3(90.68,82.6)
$2N3848: length 27.9
  Top Layer w1.27: 79.76,63.78 84.83,63.78 85.72,64.68 85.72,71.42 87.16,72.86 87.49,72.86 87.49,74.33 87.88,74.73 91.94,74.73 ; 92.09,72.86 92.09,74.58 91.94,74.73 ; 91.94,74.73 U29.3
$2N3894: length 15.3
  Top Layer w1.27: R50.2 95.85,58.22 R49.1 95.88,70.79 U29.5
$2N4058: length 36.5
  Top Layer w1.27: C62.1 87.94,63.82 D2.2 ; C62.1 C61.1 77.85,50.97 F1.1 ; C62.1 87.94,56.38 88.9,55.42 96.52,55.42 97.88,56.78 R49.2
$2N9131: length 22.5
  Top Layer w0.66: D3.2 45.71,5.2 47.43,3.48 55.63,3.48 57.15,5 57.15,8.53 56.49,9.19 54.72,9.19 53.21,10.7 53.21,11.18
$2N9137: length 7
  Top Layer w0.66: D3.3 48.01,6.31 48.82,5.51 52.21,5.51 52.82,6.12 C64.2
$2N9204: length 2.8
  Top Layer w0.66: 53.09,8.81 52.83,9.07 52.83,9.36 51.94,10.25 51.94,11.18
$2N9259: length 2.3
  Top Layer w0.66: 50.55,8.94 50.67,9.07 C65.1 50.67,11.18

## Copper pours and planes (outline as drawn; the poured copper is in the pictures)
AGND on Top Layer: 42.29,-0.07 42.29,11.66 39.68,14.28 39.68,27.03 43.69,31.04 64.39,31.04 74.17,21.26 87.12,21.26 92.2,16.18 98.81,16.18 99.95,15.04 99.95,-0.33 42.55,-0.33
AGND on Bottom Layer: 42.2,0.12 42.2,11.85 39.59,14.47 39.59,27.22 43.6,31.23 64.3,31.23 74.08,21.45 87.03,21.45 92.11,16.37 98.72,16.37 99.86,15.23 99.86,-0.14 42.46,-0.14
GND on Top Layer: -5.84,106.48 104.27,106.48 104.27,-10.74 -5.84,-10.74
GND on Bottom Layer: -11.94,112.57 113.41,112.57 113.41,-19.51 -11.94,-19.51
$2N3678 on Top Layer: 82.3,84.63 100,84.63 100,53.19 99.44,52.63 73.15,52.63 72.52,53.26 72.52,74.85
$2N3678 on Bottom Layer: 82.02,84.63 99.72,84.63 99.72,53.19 99.16,52.63 72.87,52.63 72.24,53.26 72.24,74.85

Small or netless copper shapes (teardrops, artwork), in the pictures only: 394 on Top Layer, 72 on Bottom Layer

## Text on the board
Top Silkscreen Layer: A4 | 5V | A5 | 3V3 | A6 | A7 | C4 | C5 | G | B0 | B2 | E15 | E8 | E14 | E9 | E13 | E10 | E11 | E12 | PB10 | PB11 | IIC2_SCL | V | IIC2_SDA | CLK | DIO | TX | RX | PA0 | PA1 | IIC1_SCL | PB6 | IIC1_SDA | PB7 | PD2 | PC12 | TIM3 | TIM4 | PA8 | PA9 | 12 | 24
